# EAGLE schematic FJ60BLE (EAGLE 9.6.2)
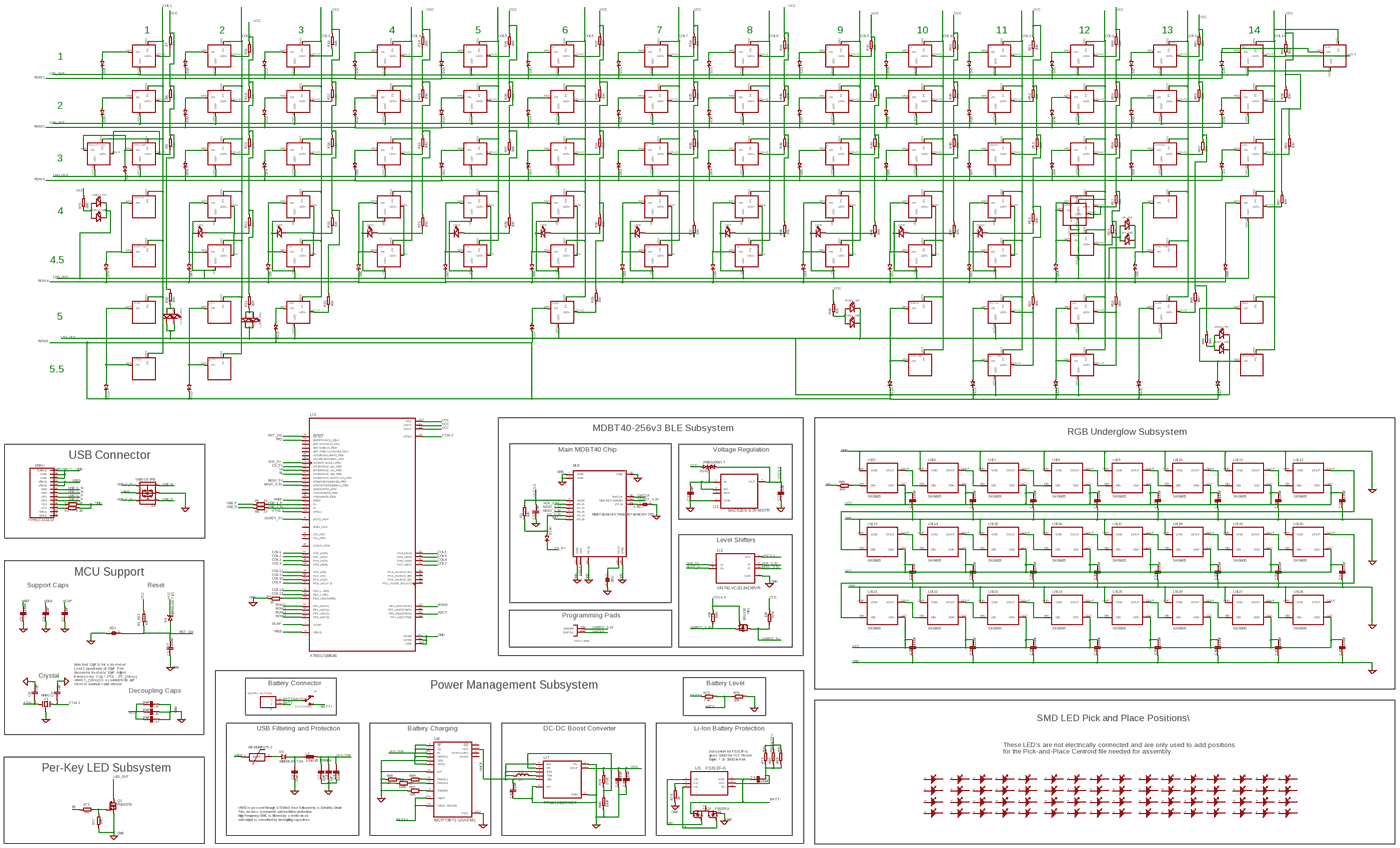
[diagram p0: schematic, sheet 1, overview]
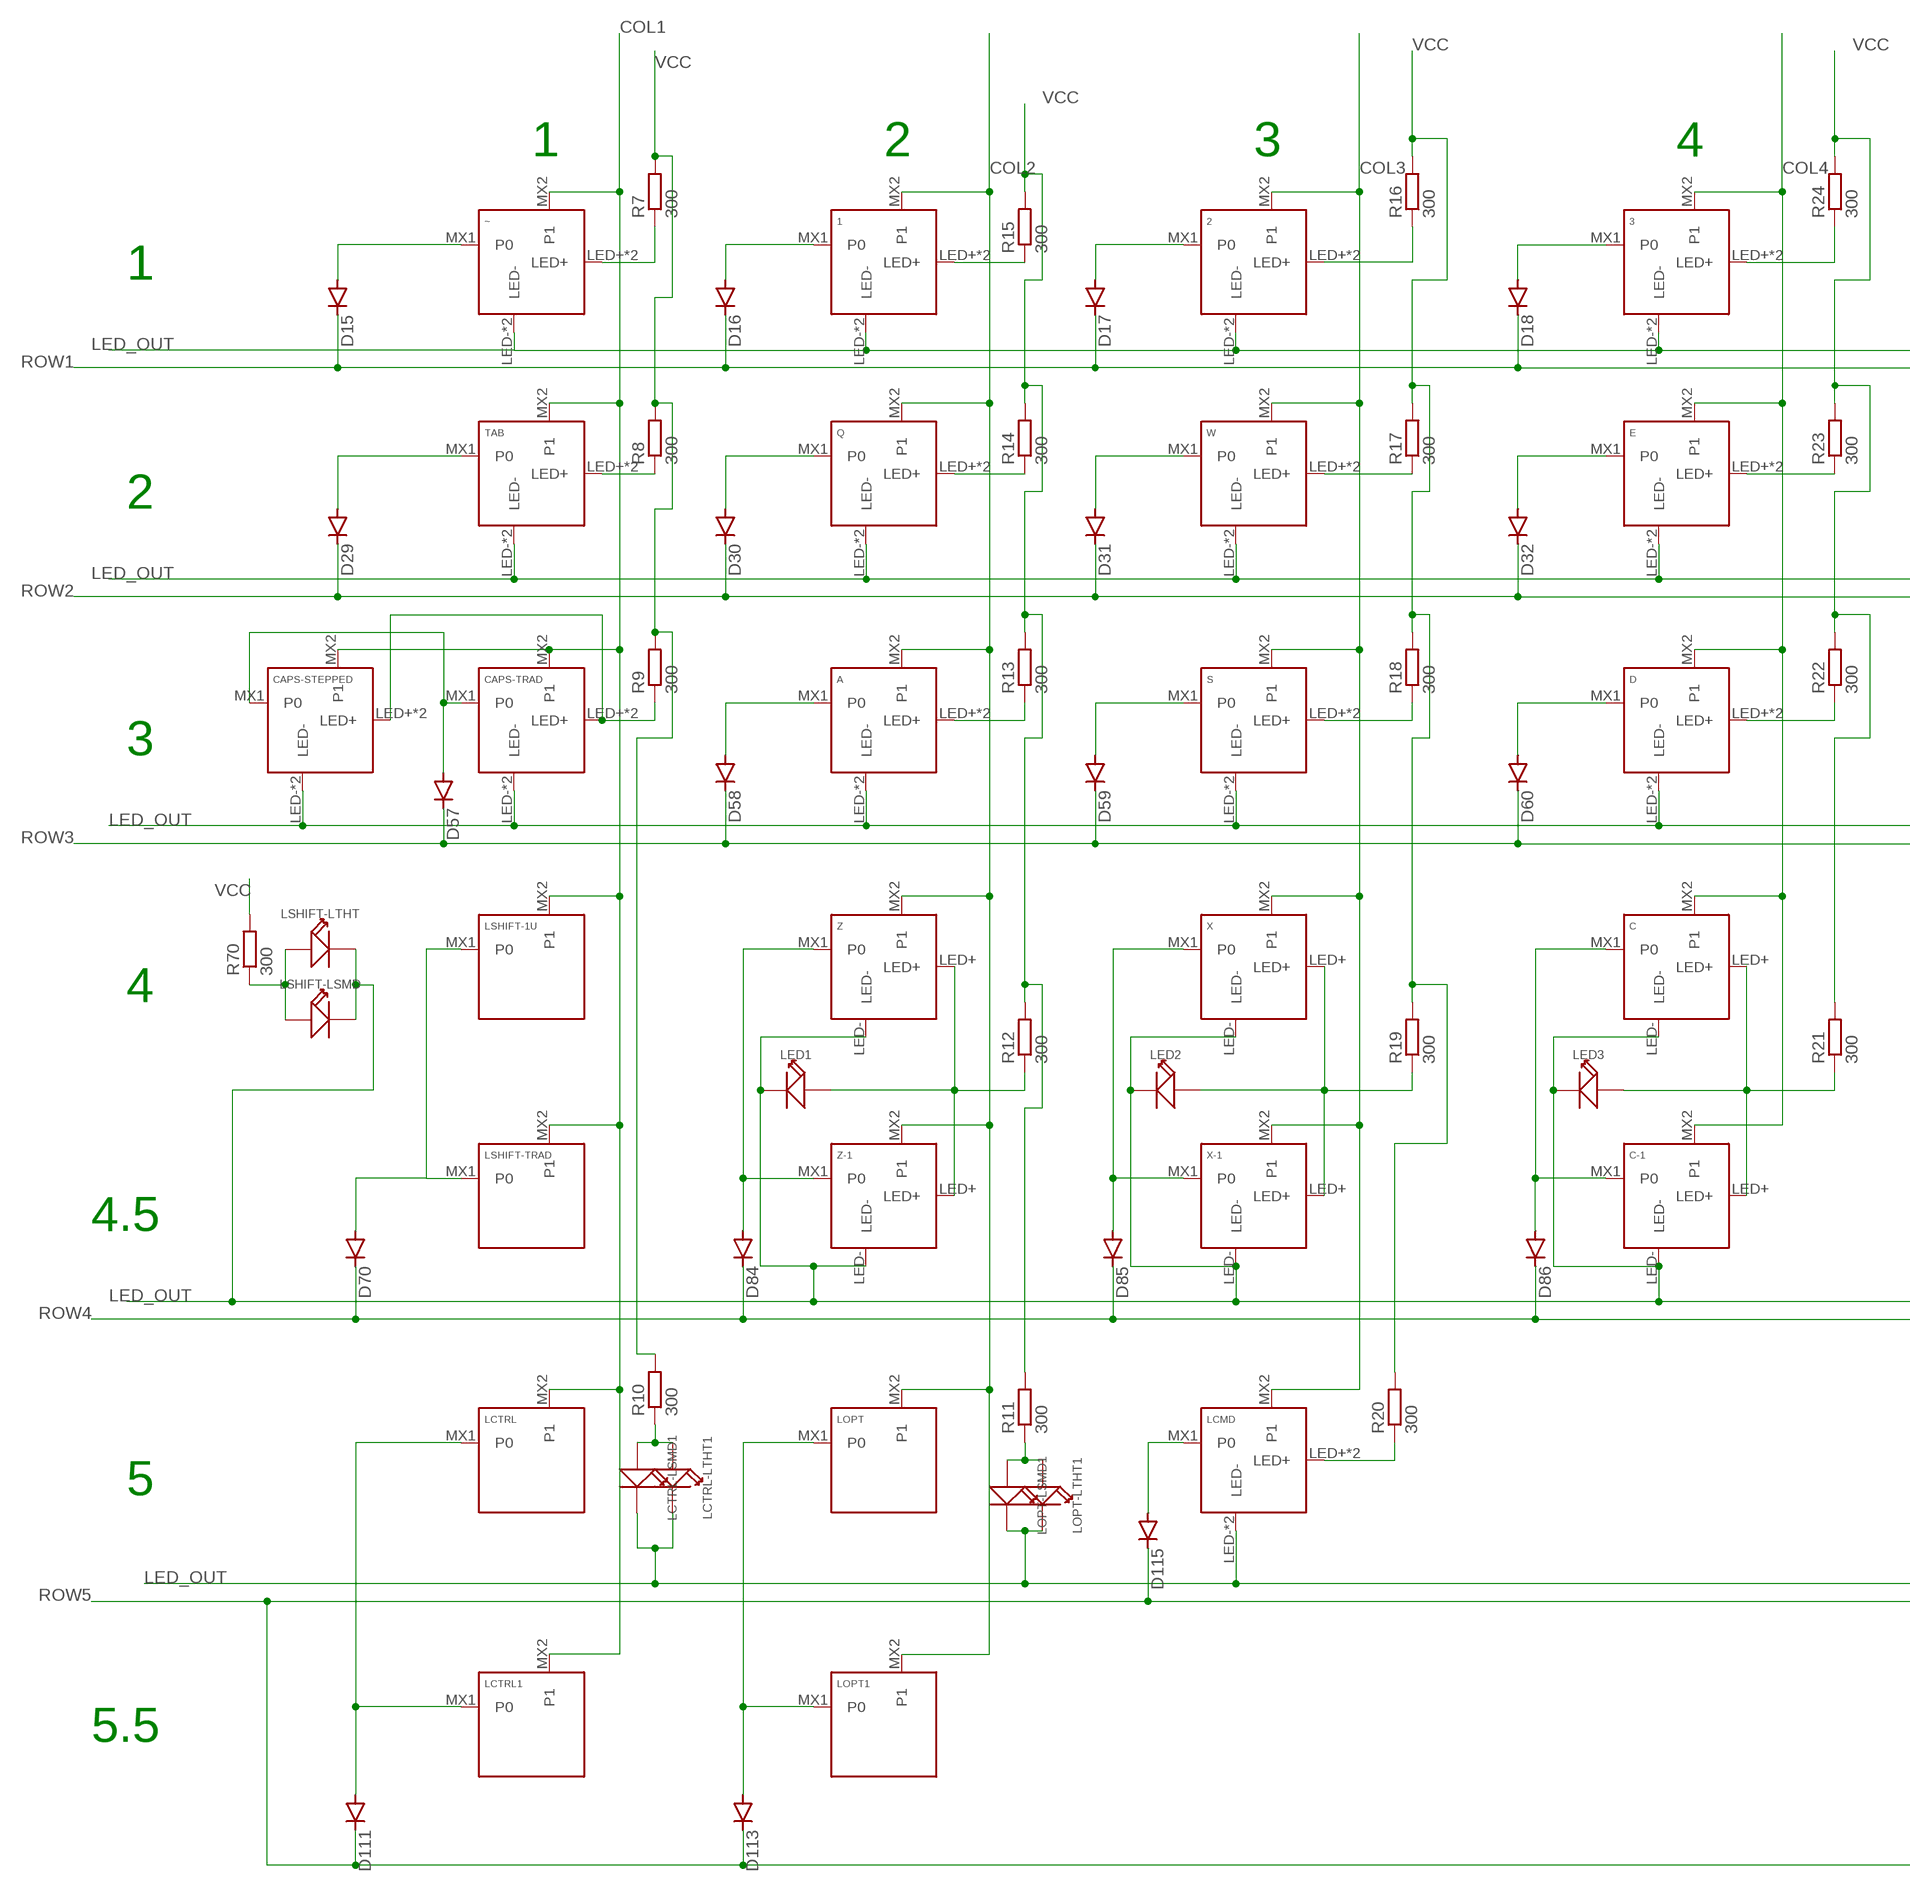
[diagram p1: schematic, sheet 1, part 1 of 6]
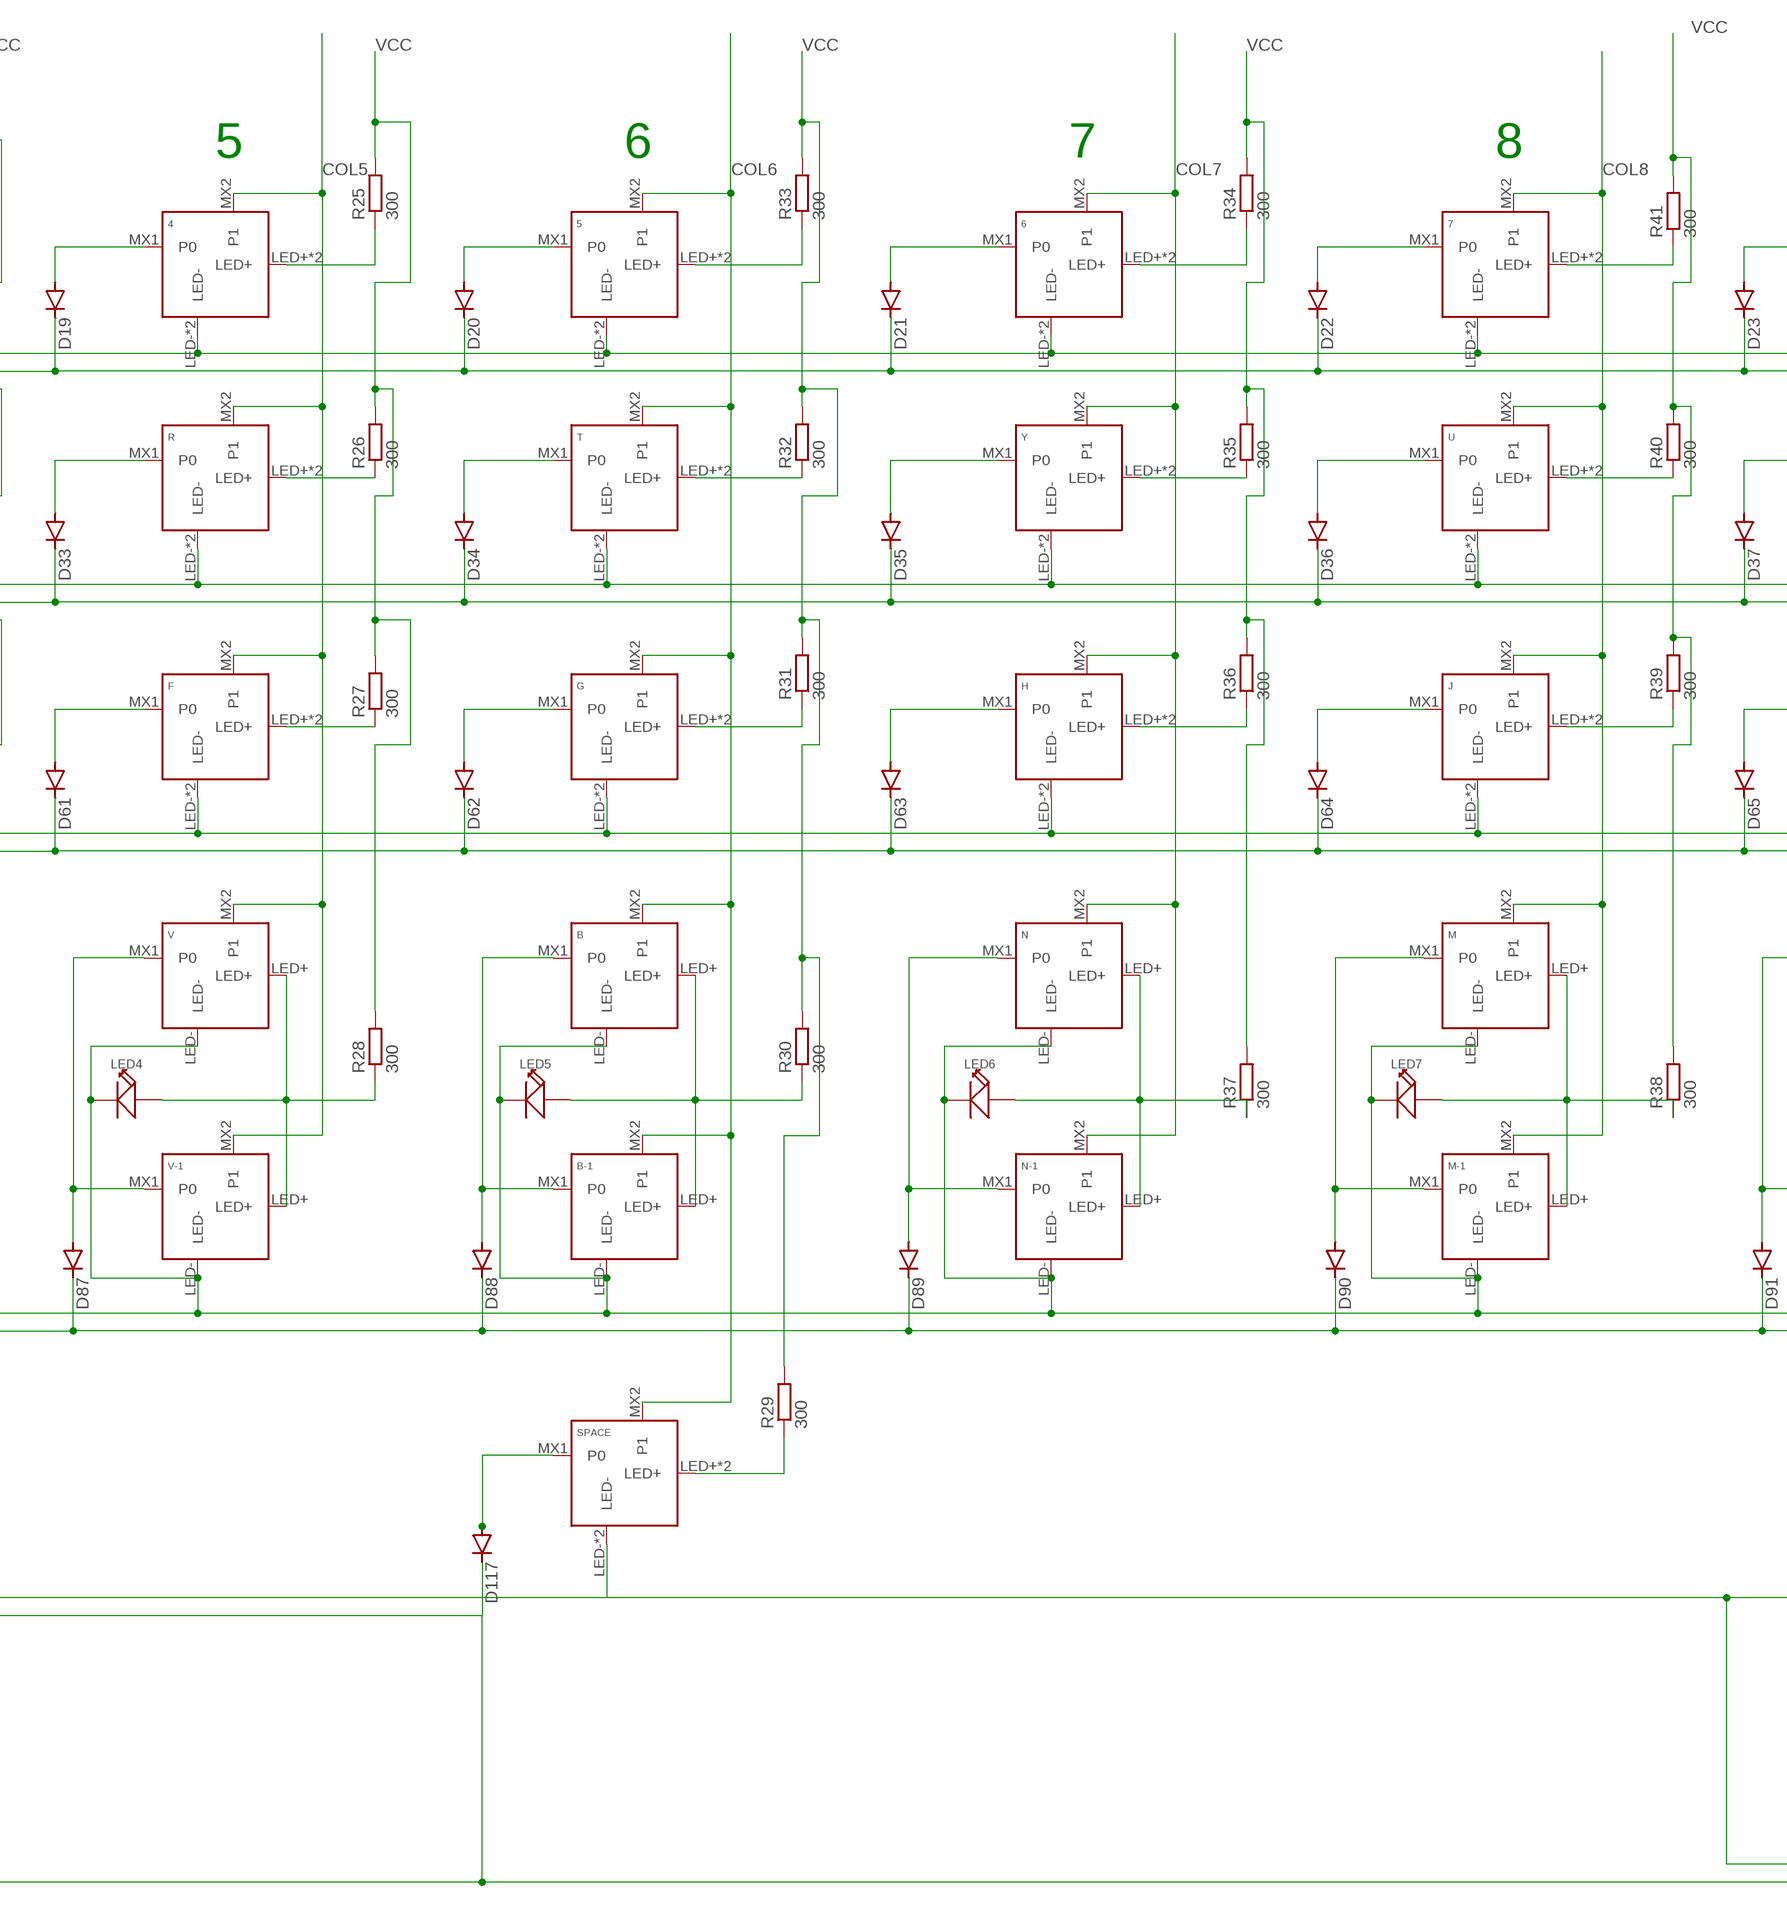
[diagram p2: schematic, sheet 1, part 2 of 6]
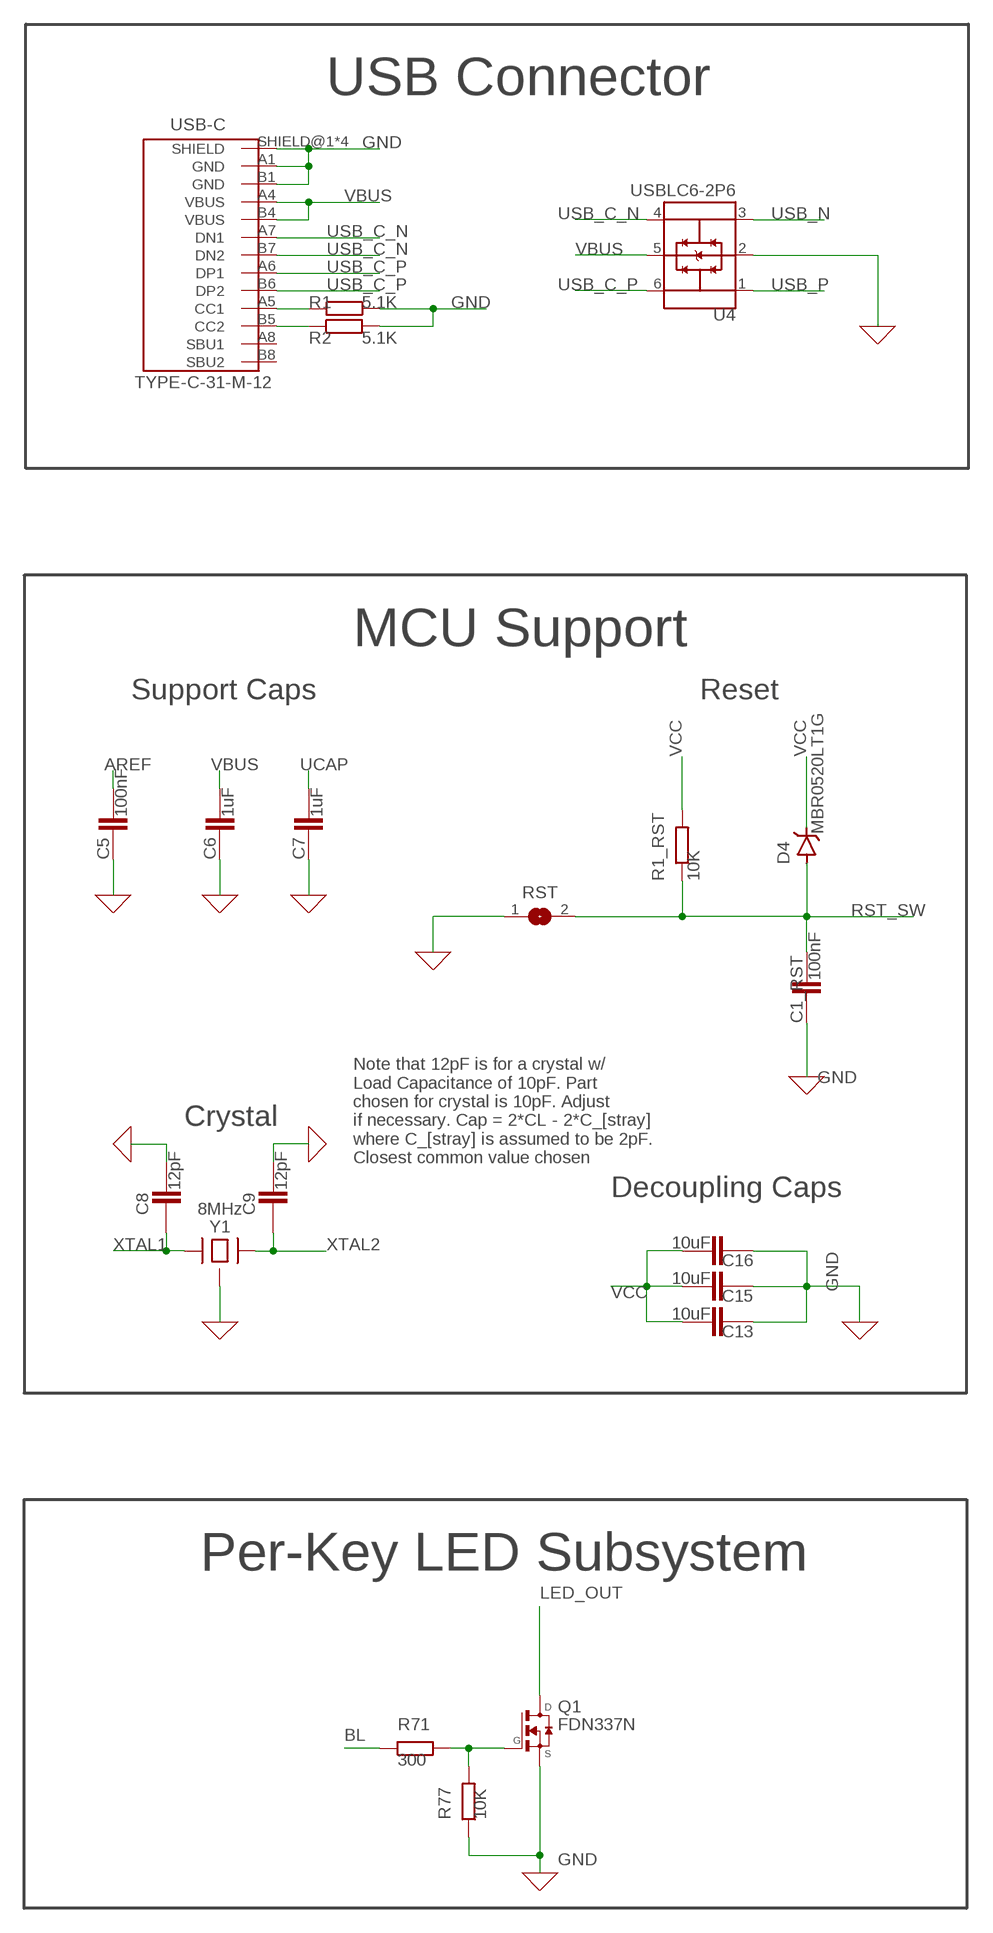
[diagram p3: schematic, sheet 1, part 3 of 6]
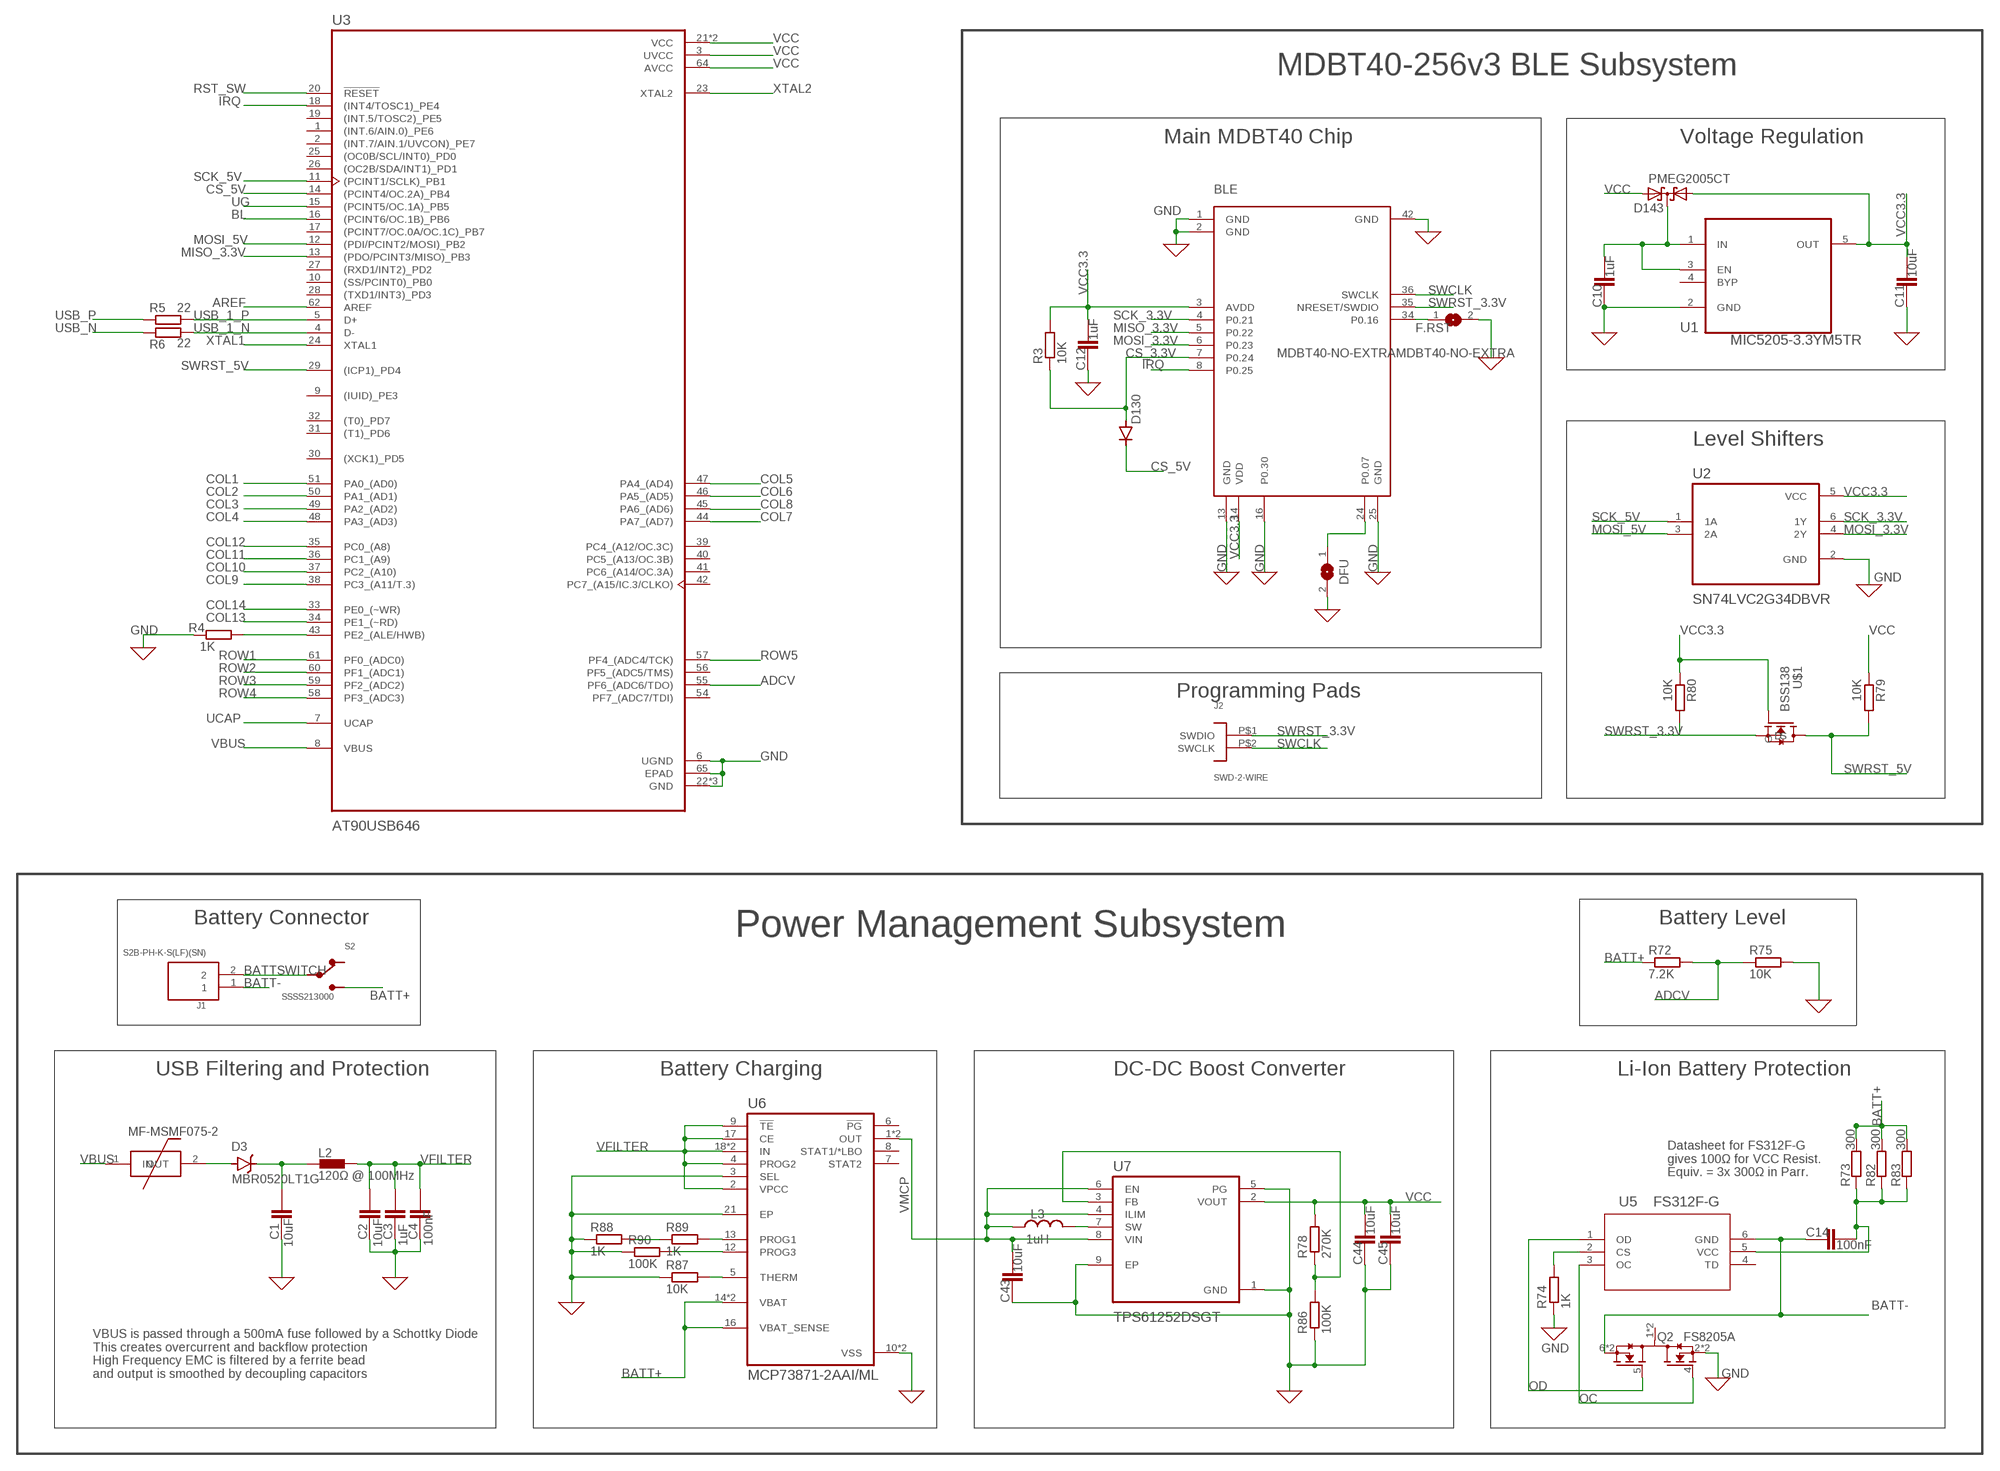
[diagram p4: schematic, sheet 1, part 4 of 6]
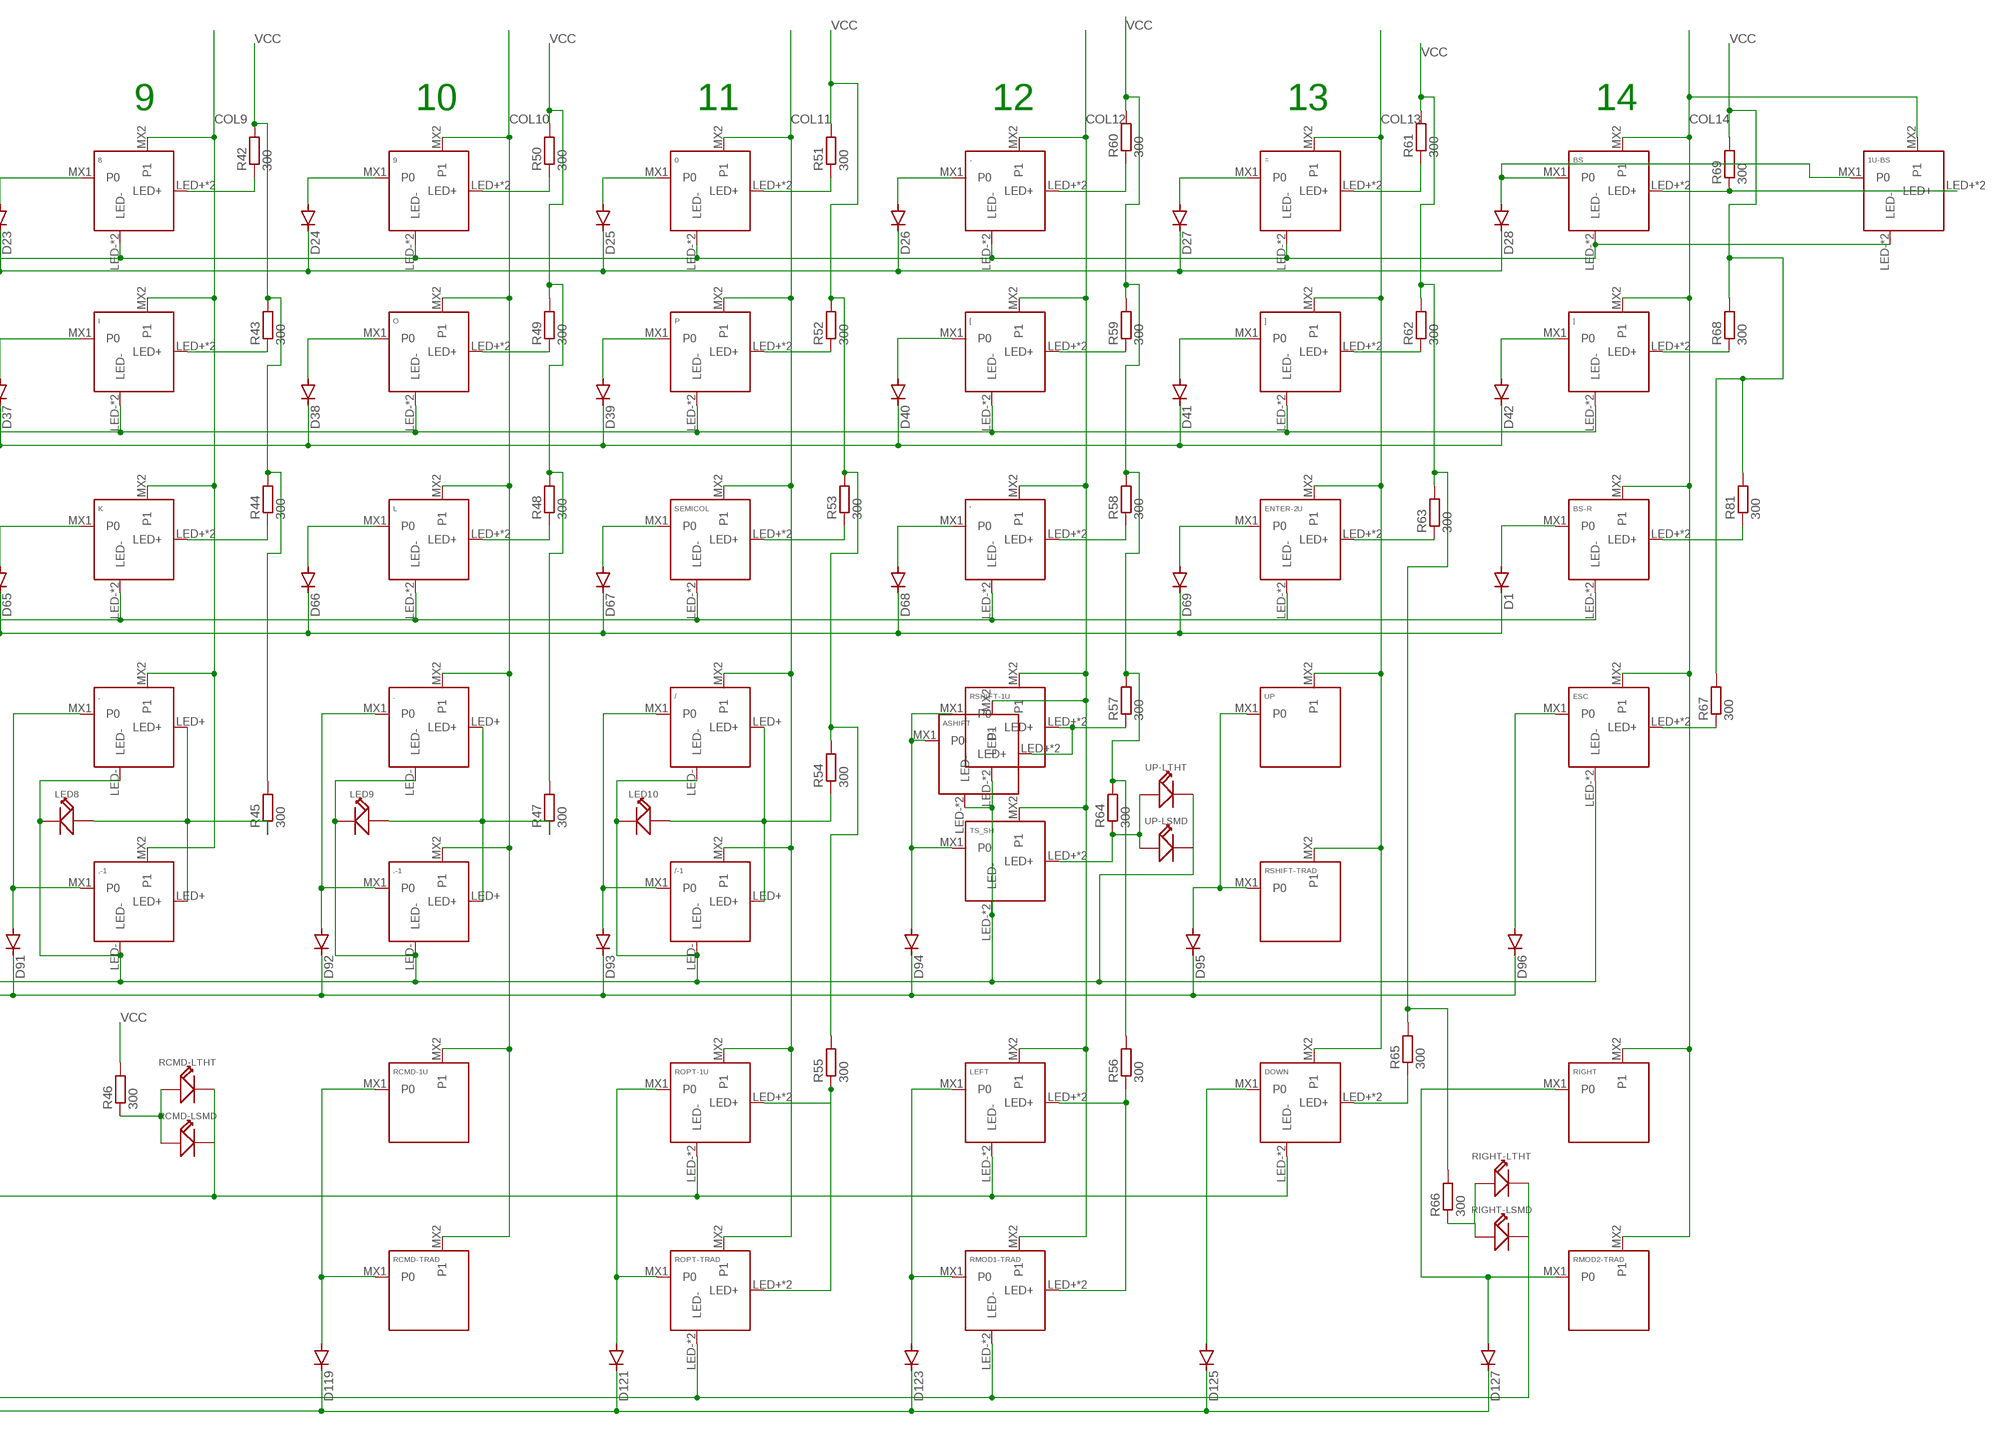
[diagram p5: schematic, sheet 1, part 5 of 6]
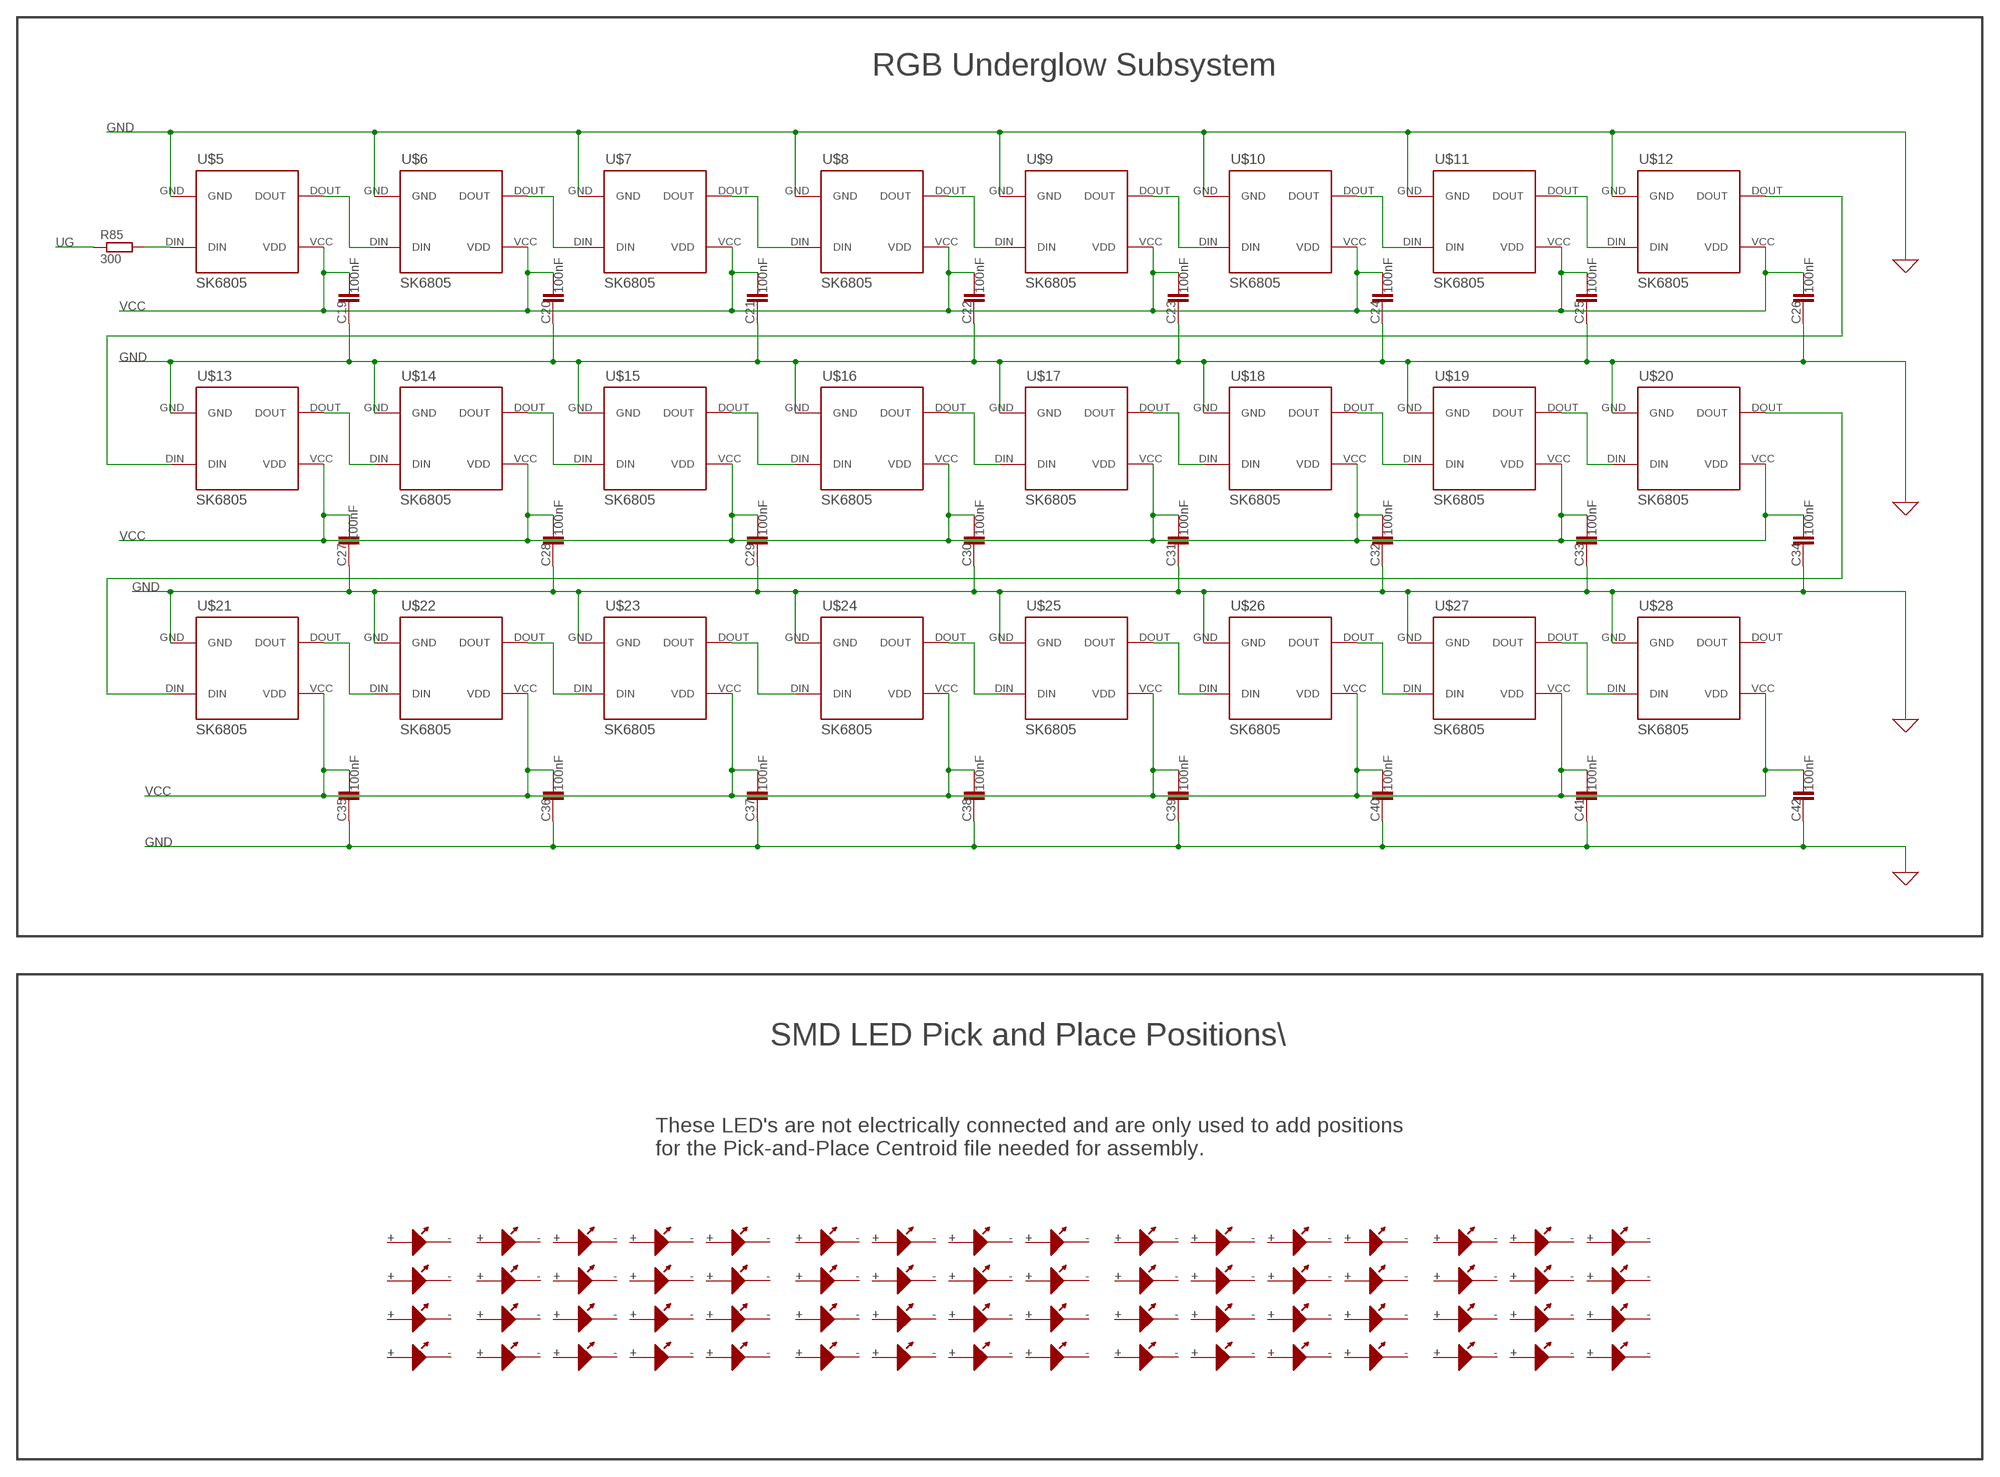
[diagram p6: schematic, sheet 1, part 6 of 6]

## Parts
0  KEYSWITCH-THTSMDLED-MX-1U-THTSMDLED  [MX-1U-THTSMDLED]
1  KEYSWITCH-THTSMDLED-MX-1U-THTSMDLED  [MX-1U-THTSMDLED]
1U-BS  KEYSWITCH-THTSMDLED-MX-1U-THTSMDLED  [MX-1U-THTSMDLED]
2  KEYSWITCH-THTSMDLED-MX-1U-THTSMDLED  [MX-1U-THTSMDLED]
3  KEYSWITCH-THTSMDLED-MX-1U-THTSMDLED  [MX-1U-THTSMDLED]
4  KEYSWITCH-THTSMDLED-MX-1U-THTSMDLED  [MX-1U-THTSMDLED]
5  KEYSWITCH-THTSMDLED-MX-1U-THTSMDLED  [MX-1U-THTSMDLED]
6  KEYSWITCH-THTSMDLED-MX-1U-THTSMDLED  [MX-1U-THTSMDLED]
7  KEYSWITCH-THTSMDLED-MX-1U-THTSMDLED  [MX-1U-THTSMDLED]
8  KEYSWITCH-THTSMDLED-MX-1U-THTSMDLED  [MX-1U-THTSMDLED]
9  KEYSWITCH-THTSMDLED-MX-1U-THTSMDLED  [MX-1U-THTSMDLED]
'  KEYSWITCH-THTSMDLED-MX-1U-THTSMDLED  [MX-1U-THTSMDLED]
,  KEYSWITCH-LED-MX-1U-LED  [MX-1U-LED]
,-1  KEYSWITCH-LED-MX-1U-LED  [MX-1U-LED]
-  KEYSWITCH-THTSMDLED-MX-1U-THTSMDLED  [MX-1U-THTSMDLED]
.  KEYSWITCH-LED-MX-1U-LED  [MX-1U-LED]
.-1  KEYSWITCH-LED-MX-1U-LED  [MX-1U-LED]
/  KEYSWITCH-LED-MX-1U-LED  [MX-1U-LED]
/-1  KEYSWITCH-LED-MX-1U-LED  [MX-1U-LED]
=  KEYSWITCH-THTSMDLED-MX-1U-THTSMDLED  [MX-1U-THTSMDLED]
[  KEYSWITCH-THTSMDLED-MX-1U-THTSMDLED  [MX-1U-THTSMDLED]
]  KEYSWITCH-THTSMDLED-MX-1U-THTSMDLED  [MX-1U-THTSMDLED]
A  KEYSWITCH-THTSMDLED-MX-1U-THTSMDLED  [MX-1U-THTSMDLED]
ASHIFT  KEYSWITCH-THTSMDLED-MX-1U-THTSMDLED  [MX-1U-THTSMDLED]
B  KEYSWITCH-LED-MX-1U-LED  [MX-1U-LED]
B-1  KEYSWITCH-LED-MX-1U-LED  [MX-1U-LED]
BLE  MDBT40-NO-EXTRAMDBT40-NO-EXTRA  [MDBT40-NO-EXTRA]
BS  KEYSWITCH-THTSMDLED-MX-2U-THTSMDLED-FLIPPED  [MX-2U-THTSMDLED-FLIPPED]
BS-R  KEYSWITCH-THTSMDLED-MX-1U-THTSMDLED  [MX-1U-THTSMDLED]
C  KEYSWITCH-LED-MX-1U-LED  [MX-1U-LED]
C1  10uF  CAPACITOR-0603  [C0603]
C1_RST  100nF  CAPACITOR-0603  [C0603]
C2  10uF  CAPACITOR-0603  [C0603]
C3  1uF  CAPACITOR-0603  [C0603]
C4  100nF  CAPACITOR-0603  [C0603]
C5  100nF  CAPACITOR-0603  [C0603]
C6  1uF  CAPACITOR-0603  [C0603]
C7  1uF  CAPACITOR-0603  [C0603]
C8  12pF  CAPACITOR-0603  [C0603]
C9  12pF  CAPACITOR-0603  [C0603]
C10  1uF  CAPACITOR-0603  [C0603]
C11  10uF  CAPACITOR-0603  [C0603]
C12  1uF  CAPACITOR-0603  [C0603]
C13  10uF  CAPACITOR-0603  [C0603]
C14  100nF  CAPACITOR-0603  [C0603]
C15  10uF  CAPACITOR-0603  [C0603]
C16  10uF  CAPACITOR-0603  [C0603]
C19  100nF  CAPACITOR-0603  [C0603]
C20  100nF  CAPACITOR-0603  [C0603]
C21  100nF  CAPACITOR-0603  [C0603]
C22  100nF  CAPACITOR-0603  [C0603]
C23  100nF  CAPACITOR-0603  [C0603]
C24  100nF  CAPACITOR-0603  [C0603]
C25  100nF  CAPACITOR-0603  [C0603]
C26  100nF  CAPACITOR-0603  [C0603]
C27  100nF  CAPACITOR-0603  [C0603]
C28  100nF  CAPACITOR-0603  [C0603]
C29  100nF  CAPACITOR-0603  [C0603]
C30  100nF  CAPACITOR-0603  [C0603]
C31  100nF  CAPACITOR-0603  [C0603]
C32  100nF  CAPACITOR-0603  [C0603]
C33  100nF  CAPACITOR-0603  [C0603]
C34  100nF  CAPACITOR-0603  [C0603]
C35  100nF  CAPACITOR-0603  [C0603]
C36  100nF  CAPACITOR-0603  [C0603]
C37  100nF  CAPACITOR-0603  [C0603]
C38  100nF  CAPACITOR-0603  [C0603]
C39  100nF  CAPACITOR-0603  [C0603]
C40  100nF  CAPACITOR-0603  [C0603]
C41  100nF  CAPACITOR-0603  [C0603]
C42  100nF  CAPACITOR-0603  [C0603]
C43  10uF  CAPACITOR-0603  [C0603]
C44  10uF  CAPACITOR-0603  [C0603]
C45  10uF  CAPACITOR-0603  [C0603]
C-1  KEYSWITCH-LED-MX-1U-LED  [MX-1U-LED]
CAPS-STEPPED  KEYSWITCH-THTSMDLED-MX-1U-THTSMDLED  [MX-1U-THTSMDLED]
CAPS-TRAD  KEYSWITCH-THTSMDLED-MX-1U-THTSMDLED  [MX-1U-THTSMDLED]
D  KEYSWITCH-THTSMDLED-MX-1U-THTSMDLED  [MX-1U-THTSMDLED]
D1  DIODE-SOD323-R  [SOD323-R]
D3  MBR0520LT1G  CESD5V0D1  [SOD-123]
D4  MBR0520LT1G  CESD5V0D1  [SOD-123]
D15  DIODE-SOD323-R  [SOD323-R]
D16  DIODE-SOD323-R  [SOD323-R]
D17  DIODE-SOD323-R  [SOD323-R]
D18  DIODE-SOD323-R  [SOD323-R]
D19  DIODE-SOD323-R  [SOD323-R]
D20  DIODE-SOD323-R  [SOD323-R]
D21  DIODE-SOD323-R  [SOD323-R]
D22  DIODE-SOD323-R  [SOD323-R]
D23  DIODE-SOD323-R  [SOD323-R]
D24  DIODE-SOD323-R  [SOD323-R]
D25  DIODE-SOD323-R  [SOD323-R]
D26  DIODE-SOD323-R  [SOD323-R]
D27  DIODE-SOD323-R  [SOD323-R]
D28  DIODE-SOD323-R  [SOD323-R]
D29  DIODE-SOD323-R  [SOD323-R]
D30  DIODE-SOD323-R  [SOD323-R]
D31  DIODE-SOD323-R  [SOD323-R]
D32  DIODE-SOD323-R  [SOD323-R]
D33  DIODE-SOD323-R  [SOD323-R]
D34  DIODE-SOD323-R  [SOD323-R]
D35  DIODE-SOD323-R  [SOD323-R]
D36  DIODE-SOD323-R  [SOD323-R]
D37  DIODE-SOD323-R  [SOD323-R]
D38  DIODE-SOD323-R  [SOD323-R]
D39  DIODE-SOD323-R  [SOD323-R]
D40  DIODE-SOD323-R  [SOD323-R]
D41  DIODE-SOD323-R  [SOD323-R]
D42  DIODE-SOD323-R  [SOD323-R]
D57  DIODE-SOD323-R  [SOD323-R]
D58  DIODE-SOD323-R  [SOD323-R]
D59  DIODE-SOD323-R  [SOD323-R]
D60  DIODE-SOD323-R  [SOD323-R]
D61  DIODE-SOD323-R  [SOD323-R]
D62  DIODE-SOD323-R  [SOD323-R]
D63  DIODE-SOD323-R  [SOD323-R]
D64  DIODE-SOD323-R  [SOD323-R]
D65  DIODE-SOD323-R  [SOD323-R]
D66  DIODE-SOD323-R  [SOD323-R]
D67  DIODE-SOD323-R  [SOD323-R]
D68  DIODE-SOD323-R  [SOD323-R]
D69  DIODE-SOD323-R  [SOD323-R]
D70  DIODE-SOD323-R  [SOD323-R]
D84  DIODE-SOD323-R  [SOD323-R]
D85  DIODE-SOD323-R  [SOD323-R]
D86  DIODE-SOD323-R  [SOD323-R]
D87  DIODE-SOD323-R  [SOD323-R]
D88  DIODE-SOD323-R  [SOD323-R]
D89  DIODE-SOD323-R  [SOD323-R]
D90  DIODE-SOD323-R  [SOD323-R]
D91  DIODE-SOD323-R  [SOD323-R]
D92  DIODE-SOD323-R  [SOD323-R]
D93  DIODE-SOD323-R  [SOD323-R]
D94  DIODE-SOD323-R  [SOD323-R]
D95  DIODE-SOD323-R  [SOD323-R]
D96  DIODE-SOD323-R  [SOD323-R]
D111  DIODE-SOD323-R  [SOD323-R]
D113  DIODE-SOD323-R  [SOD323-R]
D115  DIODE-SOD323-R  [SOD323-R]
D117  DIODE-SOD323-R  [SOD323-R]
D119  DIODE-SOD323-R  [SOD323-R]
D121  DIODE-SOD323-R  [SOD323-R]
D123  DIODE-SOD323-R  [SOD323-R]
D125  DIODE-SOD323-R  [SOD323-R]
D127  DIODE-SOD323-R  [SOD323-R]
D130  DIODE-SOD323-R  [SOD323-R]
D143  PMEG2005CT  [SOT23]
DFU  SJ  [SJ]
DOWN  KEYSWITCH-THTSMDLED-MX-1U-THTSMDLED  [MX-1U-THTSMDLED]
E  KEYSWITCH-THTSMDLED-MX-1U-THTSMDLED  [MX-1U-THTSMDLED]
ENTER-2U  KEYSWITCH-THTSMDLED-MX-2U-THTSMDLED-FLIPPED  [MX-2U-THTSMDLED-FLIPPED]
ESC  KEYSWITCH-THTSMDLED-MX-1U-THTSMDLED  [MX-1U-THTSMDLED]
F  KEYSWITCH-THTSMDLED-MX-1U-THTSMDLED  [MX-1U-THTSMDLED]
F1  MF-MSMF075-2  CAPC1210X112N1210  [CAPC1210X112N]
F.RST  SJ  [SJ]
G  KEYSWITCH-THTSMDLED-MX-1U-THTSMDLED  [MX-1U-THTSMDLED]
H  KEYSWITCH-THTSMDLED-MX-1U-THTSMDLED  [MX-1U-THTSMDLED]
I  KEYSWITCH-THTSMDLED-MX-1U-THTSMDLED  [MX-1U-THTSMDLED]
J  KEYSWITCH-THTSMDLED-MX-1U-THTSMDLED  [MX-1U-THTSMDLED]
J1  S2B-PH-K-S(LF)(SN)  [JST_S2B-PH-K-S(LF)(SN)]
J2  SWD-2-WIRE  [HEADER-2X1-2.54]
K  KEYSWITCH-THTSMDLED-MX-1U-THTSMDLED  [MX-1U-THTSMDLED]
L  KEYSWITCH-THTSMDLED-MX-1U-THTSMDLED  [MX-1U-THTSMDLED]
L2  120Ω @ 100MHz  BLM15HB221SN1  [0402]
L3  1uH  L_CHIP-0805(2012-METRIC)  [INDC2009X120]
LCMD  KEYSWITCH-THTSMDLED-MX-1U-THTSMDLED  [MX-1U-THTSMDLED]
LCTRL  KEYSWITCH-PLAIN-MX-1U  [MX-1U]
LCTRL1  KEYSWITCH-PLAIN-MX-1U  [MX-1U]
LCTRL-LSMD1  LED-2-PLACEMENT-SMD  [SMD-LED-UNIVERSAL-2-PLACEMENTS]
LCTRL-LTHT1  LED-2-PLACEMENT-THT  [LED-THT-2PLACEMENT]
LED1  LED-4-PLACEMENT-SMD  [SMD-LED-UNIVERSAL-DUAL]
LED2  LED-4-PLACEMENT-SMD  [SMD-LED-UNIVERSAL-DUAL]
LED3  LED-4-PLACEMENT-SMD  [SMD-LED-UNIVERSAL-DUAL]
LED4  LED-4-PLACEMENT-SMD  [SMD-LED-UNIVERSAL-DUAL]
LED5  LED-4-PLACEMENT-SMD  [SMD-LED-UNIVERSAL-DUAL]
LED6  LED-4-PLACEMENT-SMD  [SMD-LED-UNIVERSAL-DUAL]
LED7  LED-4-PLACEMENT-SMD  [SMD-LED-UNIVERSAL-DUAL]
LED8  LED-4-PLACEMENT-SMD  [SMD-LED-UNIVERSAL-DUAL]
LED9  LED-4-PLACEMENT-SMD  [SMD-LED-UNIVERSAL-DUAL]
LED10  LED-4-PLACEMENT-SMD  [SMD-LED-UNIVERSAL-DUAL]
LEFT  KEYSWITCH-THTSMDLED-MX-1U-THTSMDLED  [MX-1U-THTSMDLED]
LOPT  KEYSWITCH-PLAIN-MX-1U  [MX-1U]
LOPT1  KEYSWITCH-PLAIN-MX-1U  [MX-1U]
LOPT-LSMD1  LED-2-PLACEMENT-SMD  [SMD-LED-UNIVERSAL-2-PLACEMENTS]
LOPT-LTHT1  LED-2-PLACEMENT-THT  [LED-THT-2PLACEMENT]
LSHIFT-1U  KEYSWITCH-PLAIN-MX-2U-FLIPPED  [MX-2U-FLIPPED]
LSHIFT-LSMD  LED-2-PLACEMENT-SMD  [SMD-LED-UNIVERSAL-2-PLACEMENTS]
LSHIFT-LTHT  LED-2-PLACEMENT-THT  [LED-THT-2PLACEMENT]
LSHIFT-TRAD  KEYSWITCH-PLAIN-MX-2U-FLIPPED  [MX-2U-FLIPPED]
M  KEYSWITCH-LED-MX-1U-LED  [MX-1U-LED]
M-1  KEYSWITCH-LED-MX-1U-LED  [MX-1U-LED]
N  KEYSWITCH-LED-MX-1U-LED  [MX-1U-LED]
N-1  KEYSWITCH-LED-MX-1U-LED  [MX-1U-LED]
O  KEYSWITCH-THTSMDLED-MX-1U-THTSMDLED  [MX-1U-THTSMDLED]
P  KEYSWITCH-THTSMDLED-MX-1U-THTSMDLED  [MX-1U-THTSMDLED]
Q  KEYSWITCH-THTSMDLED-MX-1U-THTSMDLED  [MX-1U-THTSMDLED]
Q1  FDN337N  [SSOT-3]
Q2  FS8205A  [SOP65P640X120-8N]
R  KEYSWITCH-THTSMDLED-MX-1U-THTSMDLED  [MX-1U-THTSMDLED]
R1  5.1K  RESISTOR-0405  [R0402]
R1_RST  10K  RESISTOR-0405  [R0402]
R2  5.1K  RESISTOR-0405  [R0402]
R3  10K  RESISTOR-0405  [R0402]
R4  1K  RESISTOR-0405  [R0402]
R5  22  RESISTOR-0405  [R0402]
R6  22  RESISTOR-0405  [R0402]
R7  300  RESISTOR-0603  [R0603]
R8  300  RESISTOR-0603  [R0603]
R9  300  RESISTOR-0603  [R0603]
R10  300  RESISTOR-0603  [R0603]
R11  300  RESISTOR-0603  [R0603]
R12  300  RESISTOR-0603  [R0603]
R13  300  RESISTOR-0603  [R0603]
R14  300  RESISTOR-0603  [R0603]
R15  300  RESISTOR-0603  [R0603]
R16  300  RESISTOR-0603  [R0603]
R17  300  RESISTOR-0603  [R0603]
R18  300  RESISTOR-0603  [R0603]
R19  300  RESISTOR-0603  [R0603]
R20  300  RESISTOR-0603  [R0603]
R21  300  RESISTOR-0603  [R0603]
R22  300  RESISTOR-0603  [R0603]
R23  300  RESISTOR-0603  [R0603]
R24  300  RESISTOR-0603  [R0603]
R25  300  RESISTOR-0603  [R0603]
R26  300  RESISTOR-0603  [R0603]
R27  300  RESISTOR-0603  [R0603]
R28  300  RESISTOR-0603  [R0603]
R29  300  RESISTOR-0603  [R0603]
R30  300  RESISTOR-0603  [R0603]
R31  300  RESISTOR-0603  [R0603]
R32  300  RESISTOR-0603  [R0603]
R33  300  RESISTOR-0603  [R0603]
R34  300  RESISTOR-0603  [R0603]
R35  300  RESISTOR-0603  [R0603]
R36  300  RESISTOR-0603  [R0603]
R37  300  RESISTOR-0603  [R0603]
R38  300  RESISTOR-0603  [R0603]
R39  300  RESISTOR-0603  [R0603]
R40  300  RESISTOR-0603  [R0603]
R41  300  RESISTOR-0603  [R0603]
R42  300  RESISTOR-0603  [R0603]
R43  300  RESISTOR-0603  [R0603]
R44  300  RESISTOR-0603  [R0603]
R45  300  RESISTOR-0603  [R0603]
R46  300  RESISTOR-0603  [R0603]
R47  300  RESISTOR-0603  [R0603]
R48  300  RESISTOR-0603  [R0603]
R49  300  RESISTOR-0603  [R0603]
R50  300  RESISTOR-0603  [R0603]
R51  300  RESISTOR-0603  [R0603]
R52  300  RESISTOR-0603  [R0603]
R53  300  RESISTOR-0603  [R0603]
R54  300  RESISTOR-0603  [R0603]
R55  300  RESISTOR-0603  [R0603]
R56  300  RESISTOR-0603  [R0603]
R57  300  RESISTOR-0603  [R0603]
R58  300  RESISTOR-0603  [R0603]
R59  300  RESISTOR-0603  [R0603]
R60  300  RESISTOR-0603  [R0603]
R61  300  RESISTOR-0603  [R0603]
R62  300  RESISTOR-0603  [R0603]
R63  300  RESISTOR-0603  [R0603]
R64  300  RESISTOR-0603  [R0603]
R65  300  RESISTOR-0603  [R0603]
R66  300  RESISTOR-0603  [R0603]
R67  300  RESISTOR-0603  [R0603]
R68  300  RESISTOR-0603  [R0603]
R69  300  RESISTOR-0603  [R0603]
R70  300  RESISTOR-0603  [R0603]
R71  300  RESISTOR-0603  [R0603]
R72  7.2K  RESISTOR-0405  [R0402]
R73  300  RESISTOR-0603  [R0603]
R74  1K  RESISTOR-0405  [R0402]
R75  10K  RESISTOR-0405  [R0402]
R77  10K  RESISTOR-0405  [R0402]
R78  270K  RESISTOR-0405  [R0402]
R79  10K  RESISTOR-0405  [R0402]
R80  10K  RESISTOR-0405  [R0402]
R81  300  RESISTOR-0603  [R0603]
R82  300  RESISTOR-0603  [R0603]
R83  300  RESISTOR-0603  [R0603]
R85  300  RESISTOR-0603  [R0603]
R86  100K  RESISTOR-0405  [R0402]
R87  10K  RESISTOR-0405  [R0402]
R88  1K  RESISTOR-0405  [R0402]
R89  1K  RESISTOR-0405  [R0402]
R90  100K  RESISTOR-0405  [R0402]
RCMD-1U  KEYSWITCH-PLAIN-MX-1U  [MX-1U]
RCMD-LSMD  LED-2-PLACEMENT-SMD  [SMD-LED-UNIVERSAL-2-PLACEMENTS]
RCMD-LTHT  LED-2-PLACEMENT-THT  [LED-THT-2PLACEMENT]
RCMD-TRAD  KEYSWITCH-PLAIN-MX-1U  [MX-1U]
RIGHT  KEYSWITCH-PLAIN-MX-1U  [MX-1U]
RIGHT-LSMD  LED-2-PLACEMENT-SMD  [SMD-LED-UNIVERSAL-2-PLACEMENTS]
RIGHT-LTHT  LED-2-PLACEMENT-THT  [LED-THT-2PLACEMENT]
RMOD1-TRAD  KEYSWITCH-THTSMDLED-MX-1U-THTSMDLED  [MX-1U-THTSMDLED]
RMOD2-TRAD  KEYSWITCH-PLAIN-MX-1U  [MX-1U]
ROPT-1U  KEYSWITCH-THTSMDLED-MX-1U-THTSMDLED  [MX-1U-THTSMDLED]
ROPT-TRAD  KEYSWITCH-THTSMDLED-MX-1U-THTSMDLED  [MX-1U-THTSMDLED]
RSHIFT-1U  KEYSWITCH-THTSMDLED-MX-1U-THTSMDLED  [MX-1U-THTSMDLED]
RSHIFT-TRAD  KEYSWITCH-PLAIN-MX-1U  [MX-1U]
RST  SJ  [SJ]
S  KEYSWITCH-THTSMDLED-MX-1U-THTSMDLED  [MX-1U-THTSMDLED]
S2  SSSS213000  [SSSS213000]
SEMICOL  KEYSWITCH-THTSMDLED-MX-1U-THTSMDLED  [MX-1U-THTSMDLED]
SPACE  KEYSWITCH-THTSMDLED-MX-6.25U-THTSMDLED  [MX-6.25U-THTSMDLED]
T  KEYSWITCH-THTSMDLED-MX-1U-THTSMDLED  [MX-1U-THTSMDLED]
TAB  KEYSWITCH-THTSMDLED-MX-1U-THTSMDLED  [MX-1U-THTSMDLED]
TS_SH  KEYSWITCH-THTSMDLED-MX-1U-THTSMDLED  [MX-1U-THTSMDLED]
U  KEYSWITCH-THTSMDLED-MX-1U-THTSMDLED  [MX-1U-THTSMDLED]
U1  MIC5205-3.3YM5TR  [SOT95P280X130-5N]
U2  SN74LVC2G34DBVR  [SOT95P280X145-6N]
U3  AT90USB646  AT90USB1286-MU  [QFN50P900X900X100-65N]
U4  USBLC6-2P6  [SOT50P160X60-6N]
U5  FS312F-G  [FS312F-G]
U6  MCP73871-2AAI/ML  [QFN50P400X400X100-21N]
U7  TPS61252DSGT  [SON50P200X200X80-9N]
U$1  BSS138  [SOT-23]
U$5  SK6805  [SK6805]
U$6  SK6805  [SK6805]
U$7  SK6805  [SK6805]
U$8  SK6805  [SK6805]
U$9  SK6805  [SK6805]
U$10  SK6805  [SK6805]
U$11  SK6805  [SK6805]
U$12  SK6805  [SK6805]
U$13  SK6805  [SK6805]
U$14  SK6805  [SK6805]
U$15  SK6805  [SK6805]
U$16  SK6805  [SK6805]
U$17  SK6805  [SK6805]
U$18  SK6805  [SK6805]
U$19  SK6805  [SK6805]
U$20  SK6805  [SK6805]
U$21  SK6805  [SK6805]
U$22  SK6805  [SK6805]
U$23  SK6805  [SK6805]
U$24  SK6805  [SK6805]
U$25  SK6805  [SK6805]
U$26  SK6805  [SK6805]
U$27  SK6805  [SK6805]
U$28  SK6805  [SK6805]
U$29  LED-0805  [LED0805]
U$30  LED-0805  [LED0805]
U$31  LED-0805  [LED0805]
U$32  LED-0805  [LED0805]
U$33  LED-0805  [LED0805]
U$34  LED-0805  [LED0805]
U$35  LED-0805  [LED0805]
U$36  LED-0805  [LED0805]
U$37  LED-0805  [LED0805]
U$38  LED-0805  [LED0805]
U$39  LED-0805  [LED0805]
U$40  LED-0805  [LED0805]
U$41  LED-0805  [LED0805]
U$42  LED-0805  [LED0805]
U$43  LED-0805  [LED0805]
U$44  LED-0805  [LED0805]
U$45  LED-0805  [LED0805]
U$46  LED-0805  [LED0805]
U$47  LED-0805  [LED0805]
U$48  LED-0805  [LED0805]
U$49  LED-0805  [LED0805]
U$50  LED-0805  [LED0805]
U$51  LED-0805  [LED0805]
U$52  LED-0805  [LED0805]
U$53  LED-0805  [LED0805]
U$54  LED-0805  [LED0805]
U$55  LED-0805  [LED0805]
U$56  LED-0805  [LED0805]
U$57  LED-0805  [LED0805]
U$58  LED-0805  [LED0805]
U$59  LED-0805  [LED0805]
U$60  LED-0805  [LED0805]
U$61  LED-0805  [LED0805]
U$62  LED-0805  [LED0805]
U$63  LED-0805  [LED0805]
U$64  LED-0805  [LED0805]
U$65  LED-0805  [LED0805]
U$66  LED-0805  [LED0805]
U$67  LED-0805  [LED0805]
U$68  LED-0805  [LED0805]
U$69  LED-0805  [LED0805]
U$70  LED-0805  [LED0805]
U$71  LED-0805  [LED0805]
U$72  LED-0805  [LED0805]
U$73  LED-0805  [LED0805]
U$74  LED-0805  [LED0805]
U$75  LED-0805  [LED0805]
U$76  LED-0805  [LED0805]
U$77  LED-0805  [LED0805]
U$78  LED-0805  [LED0805]
U$79  LED-0805  [LED0805]
U$80  LED-0805  [LED0805]
U$81  LED-0805  [LED0805]
U$82  LED-0805  [LED0805]
U$83  LED-0805  [LED0805]
U$84  LED-0805  [LED0805]
U$85  LED-0805  [LED0805]
U$86  LED-0805  [LED0805]
U$87  LED-0805  [LED0805]
U$88  LED-0805  [LED0805]
U$89  LED-0805  [LED0805]
U$90  LED-0805  [LED0805]
U$91  LED-0805  [LED0805]
U$92  LED-0805  [LED0805]
UP  KEYSWITCH-PLAIN-MX-1U  [MX-1U]
UP-LSMD  LED-2-PLACEMENT-SMD  [SMD-LED-UNIVERSAL-2-PLACEMENTS]
UP-LTHT  LED-2-PLACEMENT-THT  [LED-THT-2PLACEMENT]
USB-C  USB-C  [TYPE-C-31-M-12]
V  KEYSWITCH-LED-MX-1U-LED  [MX-1U-LED]
V-1  KEYSWITCH-LED-MX-1U-LED  [MX-1U-LED]
W  KEYSWITCH-THTSMDLED-MX-1U-THTSMDLED  [MX-1U-THTSMDLED]
X  KEYSWITCH-LED-MX-1U-LED  [MX-1U-LED]
X-1  KEYSWITCH-LED-MX-1U-LED  [MX-1U-LED]
Y  KEYSWITCH-THTSMDLED-MX-1U-THTSMDLED  [MX-1U-THTSMDLED]
Y1  8MHz  CRYSTAL-4PIN-3.2X2.5  [CRYSTAL-3.2X2.5]
Z  KEYSWITCH-LED-MX-1U-LED  [MX-1U-LED]
Z-1  KEYSWITCH-LED-MX-1U-LED  [MX-1U-LED]
|  KEYSWITCH-THTSMDLED-MX-1U-THTSMDLED  [MX-1U-THTSMDLED]
~  KEYSWITCH-THTSMDLED-MX-1U-THTSMDLED  [MX-1U-THTSMDLED]

## Nets
ADCV: R72.2 R75.1 U3.55(PF6_(ADC6/TDO))
AREF: C5.2 U3.62(AREF)
BATT+: R72.1 R73.2 R82.2 R83.2 S2.P3 U6.14(VBAT) U6.15(VBAT) U6.16(VBAT_SENSE)
BATT-: C14.1 J1.1 Q2.6(S2) Q2.7(S2) U5.6(GND)
BATTSWITCH: J1.2 S2.P2
BL: R71.1 U3.16((PCINT6/OC.1B)_PB6)
COL1 [Matrix-Signals]: CAPS-STEPPED.MX2(P1) CAPS-TRAD.MX2(P1) LCTRL1.MX2(P1) LCTRL.MX2(P1) LSHIFT-1U.MX2(P1) LSHIFT-TRAD.MX2(P1) TAB.MX2(P1) U3.51(PA0_(AD0)) ~.MX2(P1)
COL2 [Matrix-Signals]: 1.MX2(P1) A.MX2(P1) LOPT1.MX2(P1) LOPT.MX2(P1) Q.MX2(P1) U3.50(PA1_(AD1)) Z-1.MX2(P1) Z.MX2(P1)
COL3 [Matrix-Signals]: 2.MX2(P1) LCMD.MX2(P1) S.MX2(P1) U3.49(PA2_(AD2)) W.MX2(P1) X-1.MX2(P1) X.MX2(P1)
COL4 [Matrix-Signals]: 3.MX2(P1) C-1.MX2(P1) C.MX2(P1) D.MX2(P1) E.MX2(P1) U3.48(PA3_(AD3))
COL5 [Matrix-Signals]: 4.MX2(P1) F.MX2(P1) R.MX2(P1) U3.47(PA4_(AD4)) V-1.MX2(P1) V.MX2(P1)
COL6 [Matrix-Signals]: 5.MX2(P1) B-1.MX2(P1) B.MX2(P1) G.MX2(P1) SPACE.MX2(P1) T.MX2(P1) U3.46(PA5_(AD5))
COL7 [Matrix-Signals]: 6.MX2(P1) H.MX2(P1) N-1.MX2(P1) N.MX2(P1) U3.44(PA7_(AD7)) Y.MX2(P1)
COL8 [Matrix-Signals]: 7.MX2(P1) J.MX2(P1) M-1.MX2(P1) M.MX2(P1) U3.45(PA6_(AD6)) U.MX2(P1)
COL9 [Matrix-Signals]: 8.MX2(P1) ,-1.MX2(P1) ,.MX2(P1) I.MX2(P1) K.MX2(P1) U3.38(PC3_(A11/T.3))
COL10 [Matrix-Signals]: 9.MX2(P1) .-1.MX2(P1) ..MX2(P1) L.MX2(P1) O.MX2(P1) RCMD-1U.MX2(P1) RCMD-TRAD.MX2(P1) U3.37(PC2_(A10))
COL11 [Matrix-Signals]: 0.MX2(P1) /-1.MX2(P1) /.MX2(P1) P.MX2(P1) ROPT-1U.MX2(P1) ROPT-TRAD.MX2(P1) SEMICOL.MX2(P1) U3.36(PC1_(A9))
COL12 [Matrix-Signals]: '.MX2(P1) -.MX2(P1) [.MX2(P1) ASHIFT.MX2(P1) LEFT.MX2(P1) RMOD1-TRAD.MX2(P1) RSHIFT-1U.MX2(P1) TS_SH.MX2(P1) U3.35(PC0_(A8))
COL13 [Matrix-Signals]: =.MX2(P1) ].MX2(P1) DOWN.MX2(P1) ENTER-2U.MX2(P1) RSHIFT-TRAD.MX2(P1) U3.34(PE1_(~RD)) UP.MX2(P1)
COL14 [Matrix-Signals]: 1U-BS.MX2(P1) BS-R.MX2(P1) BS.MX2(P1) ESC.MX2(P1) RIGHT.MX2(P1) RMOD2-TRAD.MX2(P1) U3.33(PE0_(~WR)) |.MX2(P1)
CS_3.3V: BLE.7(P0.24) D130.A R3.1
CS_5V: D130.C U3.14((PCINT4/OC.2A)_PB4)
GND [Power]: BLE.1(GND) BLE.2(GND) BLE.13(GND) BLE.16(P0.30) BLE.25(GND) BLE.42(GND) C1.1 C1_RST.1 C2.1 C3.1 C4.1 C5.1 C6.1 C7.1 C8.2 C9.2 C10.1 C11.1 C12.1 C13.1 C15.1 C16.1 C19.1 C20.1 C21.1 C22.1 C23.1 C24.1 C25.1 C26.1 C27.1 C28.1 C29.1 C30.1 C31.1 C32.1 C33.1 C34.1 C35.1 C36.1 C37.1 C38.1 C39.1 C40.1 C41.1 C42.1 C43.1 C44.1 C45.1 DFU.2 F.RST.2 Q1.2(S) Q2.2(S1) Q2.3(S1) R1.1 R2.2 R4.1 R74.1 R75.2 R77.1 R86.1 R87.1 R88.1 R90.1 RST.1 U1.2(GND) U2.2(GND) U3.6(UGND) U3.22(GND) U3.53(GND) U3.63(GND) U3.65(EPAD) U4.2(GND) U6.3(SEL) U6.10(VSS) U6.11(VSS) U6.21(EP) U7.1(GND) U7.5(PG) U7.9(EP) U$5.GND U$6.GND U$7.GND U$8.GND U$9.GND U$10.GND U$11.GND U$12.GND U$13.GND U$14.GND U$15.GND U$16.GND U$17.GND U$18.GND U$19.GND U$20.GND U$21.GND U$22.GND U$23.GND U$24.GND U$25.GND U$26.GND U$27.GND U$28.GND USB-C.A1(GND) USB-C.B1(GND) USB-C.SHIELD@1(SHIELD) USB-C.SHIELD@2(SHIELD) USB-C.SHIELD@3(SHIELD) USB-C.SHIELD@4(SHIELD) Y1.2(GND) Y1.4(GND)
IRQ: BLE.8(P0.25) U3.18((INT4/TOSC1)_PE4)
LED_OUT: 0.LED- 0.SMDLED-(LED-) 1.LED- 1.SMDLED-(LED-) 1U-BS.LED- 1U-BS.SMDLED-(LED-) 2.LED- 2.SMDLED-(LED-) 3.LED- 3.SMDLED-(LED-) 4.LED- 4.SMDLED-(LED-) 5.LED- 5.SMDLED-(LED-) 6.LED- 6.SMDLED-(LED-) 7.LED- 7.SMDLED-(LED-) 8.LED- 8.SMDLED-(LED-) 9.LED- 9.SMDLED-(LED-) '.LED- '.SMDLED-(LED-) ,-1.LED- ,.LED- -.LED- -.SMDLED-(LED-) .-1.LED- ..LED- /-1.LED- /.LED- =.LED- =.SMDLED-(LED-) [.LED- [.SMDLED-(LED-) ].LED- ].SMDLED-(LED-) A.LED- A.SMDLED-(LED-) ASHIFT.LED- ASHIFT.SMDLED-(LED-) B-1.LED- B.LED- BS-R.LED- BS-R.SMDLED-(LED-) BS.LED- BS.SMDLED-(LED-) C-1.LED- C.LED- CAPS-STEPPED.LED- CAPS-STEPPED.SMDLED-(LED-) CAPS-TRAD.LED- CAPS-TRAD.SMDLED-(LED-) D.LED- D.SMDLED-(LED-) DOWN.LED- DOWN.SMDLED-(LED-) E.LED- E.SMDLED-(LED-) ENTER-2U.LED- ENTER-2U.SMDLED-(LED-) ESC.LED- ESC.SMDLED-(LED-) F.LED- F.SMDLED-(LED-) G.LED- G.SMDLED-(LED-) H.LED- H.SMDLED-(LED-) I.LED- I.SMDLED-(LED-) J.LED- J.SMDLED-(LED-) K.LED- K.SMDLED-(LED-) L.LED- L.SMDLED-(LED-) LCMD.LED- LCMD.SMDLED-(LED-) LCTRL-LSMD1.MINUS1(MINUS) LCTRL-LSMD1.MINUS2(MINUS) LCTRL-LTHT1.1(MINUS) LED1.MINUS1(MINUS) LED1.MINUS2(MINUS) LED2.MINUS1(MINUS) LED2.MINUS2(MINUS) LED3.MINUS1(MINUS) LED3.MINUS2(MINUS) LED4.MINUS1(MINUS) LED4.MINUS2(MINUS) LED5.MINUS1(MINUS) LED5.MINUS2(MINUS) LED6.MINUS1(MINUS) LED6.MINUS2(MINUS) LED7.MINUS1(MINUS) LED7.MINUS2(MINUS) LED8.MINUS1(MINUS) LED8.MINUS2(MINUS) LED9.MINUS1(MINUS) LED9.MINUS2(MINUS) LED10.MINUS1(MINUS) LED10.MINUS2(MINUS) LEFT.LED- LEFT.SMDLED-(LED-) LOPT-LSMD1.MINUS1(MINUS) LOPT-LSMD1.MINUS2(MINUS) LOPT-LTHT1.1(MINUS) LSHIFT-LSMD.MINUS1(MINUS) LSHIFT-LSMD.MINUS2(MINUS) LSHIFT-LTHT.1(MINUS) M-1.LED- M.LED- N-1.LED- N.LED- O.LED- O.SMDLED-(LED-) P.LED- P.SMDLED-(LED-) Q1.3(D) Q.LED- Q.SMDLED-(LED-) R.LED- R.SMDLED-(LED-) RCMD-LSMD.MINUS1(MINUS) RCMD-LSMD.MINUS2(MINUS) RCMD-LTHT.1(MINUS) RIGHT-LSMD.MINUS1(MINUS) RIGHT-LSMD.MINUS2(MINUS) RIGHT-LTHT.1(MINUS) RMOD1-TRAD.LED- RMOD1-TRAD.SMDLED-(LED-) ROPT-1U.LED- ROPT-1U.SMDLED-(LED-) ROPT-TRAD.LED- ROPT-TRAD.SMDLED-(LED-) RSHIFT-1U.LED- RSHIFT-1U.SMDLED-(LED-) S.LED- S.SMDLED-(LED-) SEMICOL.LED- SEMICOL.SMDLED-(LED-) SPACE.LED- SPACE.SMDLED-(LED-) T.LED- T.SMDLED-(LED-) TAB.LED- TAB.SMDLED-(LED-) TS_SH.LED- TS_SH.SMDLED-(LED-) U.LED- U.SMDLED-(LED-) UP-LSMD.MINUS1(MINUS) UP-LSMD.MINUS2(MINUS) UP-LTHT.1(MINUS) V-1.LED- V.LED- W.LED- W.SMDLED-(LED-) X-1.LED- X.LED- Y.LED- Y.SMDLED-(LED-) Z-1.LED- Z.LED- |.LED- |.SMDLED-(LED-) ~.LED- ~.SMDLED-(LED-)
LSHIFT-LED-ITC1 [LED-ITC-Joins]: LSHIFT-LSMD.PLUS LSHIFT-LTHT.2(PLUS) LSHIFT-LTHT.3(PLUS) R70.1
MISO_3.3V: BLE.5(P0.22) U3.13((PDO/PCINT3/MISO)_PB3)
MOSI_3.3V: BLE.6(P0.23) U2.4(2Y)
MOSI_5V: U2.3(2A) U3.12((PDI/PCINT2/MOSI)_PB2)
N$1 [Matrix-Signals]: D15.A ~.MX1(P0)
N$2 [Matrix-Signals]: 1.MX1(P0) D16.A
N$3 [Matrix-Signals]: 3.MX1(P0) D18.A
N$4 [Matrix-Signals]: D30.A Q.MX1(P0)
N$5 [Matrix-Signals]: D29.A TAB.MX1(P0)
N$6 [Matrix-Signals]: 4.MX1(P0) D19.A
N$7 [Matrix-Signals]: D31.A W.MX1(P0)
N$8 [Matrix-Signals]: 2.MX1(P0) D17.A
N$9 [Matrix-Signals]: 5.MX1(P0) D20.A
N$10 [Matrix-Signals]: D32.A E.MX1(P0)
N$11 [Matrix-Signals]: 6.MX1(P0) D21.A
N$12 [Matrix-Signals]: D33.A R.MX1(P0)
N$13 [Matrix-Signals]: 7.MX1(P0) D22.A
N$14: R1.2 USB-C.A5(CC1)
N$15 [Matrix-Signals]: D34.A T.MX1(P0)
N$16 [Matrix-Signals]: 8.MX1(P0) D23.A
N$17 [Matrix-Signals]: D35.A Y.MX1(P0)
N$18 [Matrix-Signals]: 9.MX1(P0) D24.A
N$19 [Matrix-Signals]: D36.A U.MX1(P0)
N$20 [Matrix-Signals]: 0.MX1(P0) D25.A
N$21 [Matrix-Signals]: D37.A I.MX1(P0)
N$22 [Matrix-Signals]: -.MX1(P0) D26.A
N$23 [Matrix-Signals]: D38.A O.MX1(P0)
N$24 [Matrix-Signals]: =.MX1(P0) D27.A
N$25 [Matrix-Signals]: D39.A P.MX1(P0)
N$26 [Matrix-Signals]: 1U-BS.MX1(P0) BS.MX1(P0) D28.A
N$27: D3.A F1.2(OUT)
N$28 [Matrix-Signals]: [.MX1(P0) D40.A
N$29 [Matrix-Signals]: ].MX1(P0) D41.A
N$30 [Matrix-Signals]: D42.A |.MX1(P0)
N$31 [Power]: C1.2 D3.C L2.1
N$32 [Matrix-Signals]: A.MX1(P0) D58.A
N$33 [Matrix-Signals]: CAPS-STEPPED.MX1(P0) CAPS-TRAD.MX1(P0) D57.A
N$34 [Matrix-Signals]: D59.A S.MX1(P0)
N$35 [Matrix-Signals]: D60.A D.MX1(P0)
N$36 [Matrix-Signals]: D61.A F.MX1(P0)
N$37 [Matrix-Signals]: D62.A G.MX1(P0)
N$38 [Matrix-Signals]: D63.A H.MX1(P0)
N$39 [Matrix-Signals]: D64.A J.MX1(P0)
N$40 [Matrix-Signals]: D65.A K.MX1(P0)
N$41 [Matrix-Signals]: D66.A L.MX1(P0)
N$42 [Matrix-Signals]: D67.A SEMICOL.MX1(P0)
N$43 [Matrix-Signals]: '.MX1(P0) D68.A
N$44 [Matrix-Signals]: D69.A ENTER-2U.MX1(P0)
N$45 [Matrix-Signals]: D84.A Z-1.MX1(P0) Z.MX1(P0)
N$46: LED1.PLUS1(PLUS) LED1.PLUS2(PLUS) R12.1 Z-1.LED+ Z.LED+
N$47: R7.1 ~.LED+ ~.SMDLED+(LED+)
N$48 [Matrix-Signals]: D85.A X-1.MX1(P0) X.MX1(P0)
N$49 [Matrix-Signals]: C-1.MX1(P0) C.MX1(P0) D86.A
N$50 [Matrix-Signals]: D87.A V-1.MX1(P0) V.MX1(P0)
N$51 [Matrix-Signals]: B-1.MX1(P0) B.MX1(P0) D88.A
N$52 [Matrix-Signals]: D89.A N-1.MX1(P0) N.MX1(P0)
N$53 [Matrix-Signals]: D90.A M-1.MX1(P0) M.MX1(P0)
N$54 [Matrix-Signals]: ,-1.MX1(P0) ,.MX1(P0) D91.A
N$55 [Matrix-Signals]: D95.A RSHIFT-TRAD.MX1(P0) UP.MX1(P0)
N$56 [Matrix-Signals]: .-1.MX1(P0) ..MX1(P0) D92.A
N$57 [Matrix-Signals]: /-1.MX1(P0) /.MX1(P0) D93.A
N$58: BLE.24(P0.07) DFU.1
N$59 [Matrix-Signals]: ASHIFT.MX1(P0) D94.A RSHIFT-1U.MX1(P0) TS_SH.MX1(P0)
N$60: 2.LED+ 2.SMDLED+(LED+) R16.1
N$61 [Matrix-Signals]: D96.A ESC.MX1(P0)
N$62: R8.1 TAB.LED+ TAB.SMDLED+(LED+)
N$63 [Matrix-Signals]: D70.A LSHIFT-1U.MX1(P0) LSHIFT-TRAD.MX1(P0)
N$64: R2.1 USB-C.B5(CC2)
N$65: Q1.1(G) R71.2 R77.2
N$66: LED2.PLUS1(PLUS) LED2.PLUS2(PLUS) R19.1 X-1.LED+ X.LED+
N$67: C14.2 R73.1 R82.1 R83.1 U5.5(VCC)
N$68: LED4.PLUS1(PLUS) LED4.PLUS2(PLUS) R28.1 V-1.LED+ V.LED+
N$69: 8.LED+ 8.SMDLED+(LED+) R42.1
N$70: 5.LED+ 5.SMDLED+(LED+) R33.1
N$72: D111.A LCTRL1.MX1(P0) LCTRL.MX1(P0)
N$74: LOPT-LSMD1.PLUS LOPT-LTHT1.2(PLUS) LOPT-LTHT1.3(PLUS) R11.1
N$78: R74.2 U5.2(CS)
N$80: R78.1 R86.2 U7.3(FB)
N$82: LCTRL-LSMD1.PLUS LCTRL-LTHT1.2(PLUS) LCTRL-LTHT1.3(PLUS) R10.1
N$83: B-1.LED+ B.LED+ LED5.PLUS1(PLUS) LED5.PLUS2(PLUS) R30.1
N$84: LED6.PLUS1(PLUS) LED6.PLUS2(PLUS) N-1.LED+ N.LED+ R37.1
N$85: LED7.PLUS1(PLUS) LED7.PLUS2(PLUS) M-1.LED+ M.LED+ R38.1
N$86: ,-1.LED+ ,.LED+ LED8.PLUS1(PLUS) LED8.PLUS2(PLUS) R45.1
N$87: .-1.LED+ ..LED+ LED9.PLUS1(PLUS) LED9.PLUS2(PLUS) R47.1
N$88: /-1.LED+ /.LED+ LED10.PLUS1(PLUS) LED10.PLUS2(PLUS) R54.1
N$90: CAPS-STEPPED.LED+ CAPS-STEPPED.SMDLED+(LED+) CAPS-TRAD.LED+ CAPS-TRAD.SMDLED+(LED+) R9.1
N$91 [Matrix-Signals]: D113.A LOPT1.MX1(P0) LOPT.MX1(P0)
N$93 [Matrix-Signals]: D115.A LCMD.MX1(P0)
N$95: A.LED+ A.SMDLED+(LED+) R13.1
N$96: D117.A SPACE.MX1(P0)
N$97 [Matrix-Signals]: D119.A RCMD-1U.MX1(P0) RCMD-TRAD.MX1(P0)
N$98: Q.LED+ Q.SMDLED+(LED+) R14.1
N$99 [Matrix-Signals]: D121.A ROPT-1U.MX1(P0) ROPT-TRAD.MX1(P0)
N$100: R4.2 U3.43(PE2_(ALE/HWB))
N$101 [Matrix-Signals]: D123.A LEFT.MX1(P0) RMOD1-TRAD.MX1(P0)
N$102: 1.LED+ 1.SMDLED+(LED+) R15.1
N$103 [Matrix-Signals]: D125.A DOWN.MX1(P0)
N$105 [Matrix-Signals]: D127.A RIGHT.MX1(P0) RMOD2-TRAD.MX1(P0)
N$106: LCMD.LED+ LCMD.SMDLED+(LED+) R20.1
N$107: R18.1 S.LED+ S.SMDLED+(LED+)
N$108: R17.1 W.LED+ W.SMDLED+(LED+)
N$110: 3.LED+ 3.SMDLED+(LED+) R24.1
N$111: E.LED+ E.SMDLED+(LED+) R23.1
N$112: D.LED+ D.SMDLED+(LED+) R22.1
N$113: C-1.LED+ C.LED+ LED3.PLUS1(PLUS) LED3.PLUS2(PLUS) R21.1
N$114: F.LED+ F.SMDLED+(LED+) R27.1
N$115: R26.1 R.LED+ R.SMDLED+(LED+)
N$116: 4.LED+ 4.SMDLED+(LED+) R25.1
N$117: R32.1 T.LED+ T.SMDLED+(LED+)
N$118: G.LED+ G.SMDLED+(LED+) R31.1
N$119: R29.1 SPACE.LED+ SPACE.SMDLED+(LED+)
N$120: H.LED+ H.SMDLED+(LED+) R36.1
N$121: R35.1 Y.LED+ Y.SMDLED+(LED+)
N$122: 6.LED+ 6.SMDLED+(LED+) R34.1
N$123: 7.LED+ 7.SMDLED+(LED+) R41.1
N$124: R40.1 U.LED+ U.SMDLED+(LED+)
N$125: J.LED+ J.SMDLED+(LED+) R39.1
N$126: K.LED+ K.SMDLED+(LED+) R44.1
N$127: I.LED+ I.SMDLED+(LED+) R43.1
N$129: 9.LED+ 9.SMDLED+(LED+) R50.1
N$130: O.LED+ O.SMDLED+(LED+) R49.1
N$131: L.LED+ L.SMDLED+(LED+) R48.1
N$132: R55.1 ROPT-1U.LED+ ROPT-1U.SMDLED+(LED+) ROPT-TRAD.LED+ ROPT-TRAD.SMDLED+(LED+)
N$133: R53.1 SEMICOL.LED+ SEMICOL.SMDLED+(LED+)
N$134: P.LED+ P.SMDLED+(LED+) R52.1
N$135: 0.LED+ 0.SMDLED+(LED+) R51.1
N$136: -.LED+ -.SMDLED+(LED+) R60.1
N$137: [.LED+ [.SMDLED+(LED+) R59.1
N$138: '.LED+ '.SMDLED+(LED+) R58.1
N$139: ASHIFT.LED+ ASHIFT.SMDLED+(LED+) R57.1 RSHIFT-1U.LED+ RSHIFT-1U.SMDLED+(LED+)
N$140: LEFT.LED+ LEFT.SMDLED+(LED+) R56.1 RMOD1-TRAD.LED+ RMOD1-TRAD.SMDLED+(LED+)
N$141: DOWN.LED+ DOWN.SMDLED+(LED+) R65.1
N$142: ENTER-2U.LED+ ENTER-2U.SMDLED+(LED+) R63.1
N$143: ].LED+ ].SMDLED+(LED+) R62.1
N$144: =.LED+ =.SMDLED+(LED+) R61.1
N$145: 1U-BS.LED+ 1U-BS.SMDLED+(LED+) BS.LED+ BS.SMDLED+(LED+) R69.1
N$146: R68.1 |.LED+ |.SMDLED+(LED+)
N$147: ESC.LED+ ESC.SMDLED+(LED+) R67.1
N$148: L3.2 U7.7(SW)
N$149: BS-R.MX1(P0) D1.A
N$150: R88.2 R89.1
N$151: R87.2 U6.5(THERM)
N$152: R89.2 U6.13(PROG1)
N$153: R90.2 U6.12(PROG3)
N$156: BLE.34(P0.16) F.RST.1
N$158: C10.2 D143.3(K1K2) U1.1(IN) U1.3(EN)
N$159: BS-R.LED+ BS-R.SMDLED+(LED+) R81.1
N$160: U$5.DOUT U$6.DIN
N$161: U$6.DOUT U$7.DIN
N$162: U$7.DOUT U$8.DIN
N$163: U$8.DOUT U$9.DIN
N$164: U$9.DOUT U$10.DIN
N$165: U$10.DOUT U$11.DIN
N$166: U$11.DOUT U$12.DIN
N$167: U$13.DOUT U$14.DIN
N$168: U$21.DOUT U$22.DIN
N$169: U$22.DOUT U$23.DIN
N$170: U$14.DOUT U$15.DIN
N$171: U$15.DOUT U$16.DIN
N$172: U$23.DOUT U$24.DIN
N$173: U$24.DOUT U$25.DIN
N$174: U$16.DOUT U$17.DIN
N$175: U$17.DOUT U$18.DIN
N$176: U$18.DOUT U$19.DIN
N$177: U$25.DOUT U$26.DIN
N$178: U$26.DOUT U$27.DIN
N$179: U$19.DOUT U$20.DIN
N$180: U$27.DOUT U$28.DIN
N$181: R85.2 U$5.DIN
N$184: U$12.DOUT U$13.DIN
N$185: U$20.DOUT U$21.DIN
OC: Q2.4(G1) U5.3(OC)
OD: Q2.5(G2) U5.1(OD)
RCMD-LED-ITC1 [LED-ITC-Joins]: R46.1 RCMD-LSMD.PLUS RCMD-LTHT.2(PLUS) RCMD-LTHT.3(PLUS)
RIGHT-LED-ITC1 [LED-ITC-Joins]: R66.1 RIGHT-LSMD.PLUS RIGHT-LTHT.2(PLUS) RIGHT-LTHT.3(PLUS)
ROW1 [Matrix-Signals]: D15.C D16.C D17.C D18.C D19.C D20.C D21.C D22.C D23.C D24.C D25.C D26.C D27.C D28.C U3.61(PF0_(ADC0))
ROW2 [Matrix-Signals]: D29.C D30.C D31.C D32.C D33.C D34.C D35.C D36.C D37.C D38.C D39.C D40.C D41.C D42.C U3.60(PF1_(ADC1))
ROW3 [Matrix-Signals]: D1.C D57.C D58.C D59.C D60.C D61.C D62.C D63.C D64.C D65.C D66.C D67.C D68.C D69.C U3.59(PF2_(ADC2))
ROW4 [Matrix-Signals]: D70.C D84.C D85.C D86.C D87.C D88.C D89.C D90.C D91.C D92.C D93.C D94.C D95.C D96.C U3.58(PF3_(ADC3))
ROW5 [Matrix-Signals]: D111.C D113.C D115.C D117.C D119.C D121.C D123.C D125.C D127.C U3.57(PF4_(ADC4/TCK))
RST_SW: C1_RST.2 D4.A R1_RST.1 RST.2 U3.20(!RESET)
SCK_3.3V: BLE.4(P0.21) U2.6(1Y)
SCK_5V: U2.1(1A) U3.11((PCINT1/SCLK)_PB1)
SWCLK: BLE.36(SWCLK) J2.P$2(SWCLK)
SWRST_3.3V: BLE.35(NRESET/SWDIO) J2.P$1(SWDIO) R80.2 U$1.S
SWRST_5V: R79.2 U3.29((ICP1)_PD4) U$1.D
UCAP: C7.2 U3.7(UCAP)
UG: R85.1 U3.15((PCINT5/OC.1A)_PB5)
UP-LED-ITC1 [LED-ITC-Joins]: R64.1 TS_SH.LED+ TS_SH.SMDLED+(LED+) UP-LSMD.PLUS UP-LTHT.2(PLUS) UP-LTHT.3(PLUS)
USB_1_N [USB-Data]: R6.2 U3.4(D-)
USB_1_P [USB-Data]: R5.2 U3.5(D+)
USB_C_N: U4.4(I/O2_2) USB-C.A7(DN1) USB-C.B7(DN2)
USB_C_P: U4.6(I/O1_2) USB-C.A6(DP1) USB-C.B6(DP2)
USB_N [USB-Data]: R6.1 U4.3(I/O2_1)
USB_P [USB-Data]: R5.1 U4.1(I/O1_1)
VBUS: C6.2 F1.1(IN) U3.8(VBUS) U4.5(VBUS) USB-C.A4(VBUS) USB-C.B4(VBUS)
VCC [Power]: C13.2 C15.2 C16.2 C19.2 C20.2 C21.2 C22.2 C23.2 C24.2 C25.2 C26.2 C27.2 C28.2 C29.2 C30.2 C31.2 C32.2 C33.2 C34.2 C35.2 C36.2 C37.2 C38.2 C39.2 C40.2 C41.2 C42.2 C44.2 C45.2 D4.C D143.2(A2) R1_RST.2 R7.2 R8.2 R9.2 R10.2 R11.2 R12.2 R13.2 R14.2 R15.2 R16.2 R17.2 R18.2 R19.2 R20.2 R21.2 R22.2 R23.2 R24.2 R25.2 R26.2 R27.2 R28.2 R29.2 R30.2 R31.2 R32.2 R33.2 R34.2 R35.2 R36.2 R37.2 R38.2 R39.2 R40.2 R41.2 R42.2 R43.2 R44.2 R45.2 R46.2 R47.2 R48.2 R49.2 R50.2 R51.2 R52.2 R53.2 R54.2 R55.2 R56.2 R57.2 R58.2 R59.2 R60.2 R61.2 R62.2 R63.2 R64.2 R65.2 R66.2 R67.2 R68.2 R69.2 R70.2 R78.2 R79.1 R81.2 U3.3(UVCC) U3.21(VCC) U3.52(VCC) U3.64(AVCC) U7.2(VOUT) U$5.VCC(VDD) U$6.VCC(VDD) U$7.VCC(VDD) U$8.VCC(VDD) U$9.VCC(VDD) U$10.VCC(VDD) U$11.VCC(VDD) U$12.VCC(VDD) U$13.VCC(VDD) U$14.VCC(VDD) U$15.VCC(VDD) U$16.VCC(VDD) U$17.VCC(VDD) U$18.VCC(VDD) U$19.VCC(VDD) U$20.VCC(VDD) U$21.VCC(VDD) U$22.VCC(VDD) U$23.VCC(VDD) U$24.VCC(VDD) U$25.VCC(VDD) U$26.VCC(VDD) U$27.VCC(VDD) U$28.VCC(VDD)
VCC3.3 [Power]: BLE.3(AVDD) BLE.14(VDD) C11.2 C12.2 D143.1(A1) R3.2 R80.1 U1.5(OUT) U2.5(VCC) U$1.G
VFILTER: C2.2 C3.2 C4.2 L2.2 U6.2(VPCC) U6.4(PROG2) U6.9(!TE) U6.17(CE) U6.18(IN) U6.19(IN)
VMCP: C43.2 L3.1 U6.1(OUT) U6.20(OUT) U7.4(ILIM) U7.6(EN) U7.8(VIN)
XTAL1: C8.1 U3.24(XTAL1) Y1.1
XTAL2: C9.1 U3.23(XTAL2) Y1.3
Unconnected: Q2.1(D12) Q2.8(D12) S2.P1 U1.4(BYP) U3.1((INT.6/AIN.0)_PE6) U3.2((INT.7/AIN.1/UVCON)_PE7) U3.9((IUID)_PE3) U3.10((SS/PCINT0)_PB0) U3.17((PCINT7/OC.0A/OC.1C)_PB7) U3.19((INT.5/TOSC2)_PE5) U3.25((OC0B/SCL/INT0)_PD0) U3.26((OC2B/SDA/INT1)_PD1) U3.27((RXD1/INT2)_PD2) U3.28((TXD1/INT3)_PD3) U3.30((XCK1)_PD5) U3.31((T1)_PD6) U3.32((T0)_PD7) U3.39(PC4_(A12/OC.3C)) U3.40(PC5_(A13/OC.3B)) U3.41(PC6_(A14/OC.3A)) U3.42(PC7_(A15/IC.3/CLKO)) U3.54(PF7_(ADC7/TDI)) U3.56(PF5_(ADC5/TMS)) U5.4(TD) U6.6(!PG) U6.7(STAT2) U6.8(STAT1/*LBO) U$28.DOUT U$29.+ U$29.- U$30.+ U$30.- U$31.+ U$31.- U$32.+ U$32.- U$33.+ U$33.- U$34.+ U$34.- U$35.+ U$35.- U$36.+ U$36.- U$37.+ U$37.- U$38.+ U$38.- U$39.+ U$39.- U$40.+ U$40.- U$41.+ U$41.- U$42.+ U$42.- U$43.+ U$43.- U$44.+ U$44.- U$45.+ U$45.- U$46.+ U$46.- U$47.+ U$47.- U$48.+ U$48.- U$49.+ U$49.- U$50.+ U$50.- U$51.+ U$51.- U$52.+ U$52.- U$53.+ U$53.- U$54.+ U$54.- U$55.+ U$55.- U$56.+ U$56.- U$57.+ U$57.- U$58.+ U$58.- U$59.+ U$59.- U$60.+ U$60.- U$61.+ U$61.- U$62.+ U$62.- U$63.+ U$63.- U$64.+ U$64.- U$65.+ U$65.- U$66.+ U$66.- U$67.+ U$67.- U$68.+ U$68.- U$69.+ U$69.- U$70.+ U$70.- U$71.+ U$71.- U$72.+ U$72.- U$73.+ U$73.- U$74.+ U$74.- U$75.+ U$75.- U$76.+ U$76.- U$77.+ U$77.- U$78.+ U$78.- U$79.+ U$79.- U$80.+ U$80.- U$81.+ U$81.- U$82.+ U$82.- U$83.+ U$83.- U$84.+ U$84.- U$85.+ U$85.- U$86.+ U$86.- U$87.+ U$87.- U$88.+ U$88.- U$89.+ U$89.- U$90.+ U$90.- U$91.+ U$91.- U$92.+ U$92.- USB-C.A8(SBU1) USB-C.B8(SBU2)

## Notes on the sheet
- 1 | 2 | 3 | 4 | 5 | 6 | 7 | 8 | 9 | 10 | 11 | 12 | 13 | 14
- 1
- 2
- 3
- 4
- 4.5
- 5
- 5.5
- MDBT40-256v3 BLE Subsystem
- RGB Underglow Subsystem
- Main MDBT40 Chip | Voltage Regulation
- USB Connector | MDBT40 Bluetooth Module | 5V -> 3.3V Step Down | Underglow RGB LED's
- USB Connector
- Level-Shift for BLE | Level Shifters
- Decoupling Capacitors
- MCU Support | Reset Switch
- Support Caps | Reset
- Clock Signal | Programming Pads
- Crystal
- Battery Connector | Battery Level
- Note that 12pF is for a crystal w/
  Load Capacitance of 10pF. Part 
  chosen for crystal is 10pF. Adjust
  if necessary. Cap = 2*CL - 2*C_[stray]
  where C_[stray] is assumed to be 2pF. 
  Closest common value chosen
- Power Management Subsystem
- Decoupling Caps
- SMD LED Pick and Place Positions\
- USB Filtering and Protection | Battery Charging | DC-DC Boost Converter | Li-Ion Battery Protection
- Datasheet for FS312F-G
  gives 100Ω for VCC Resist.
  Equiv. = 3x 300Ω in Parr.
- These LED's are not electrically connected and are only used to add positions
  for the Pick-and-Place Centroid file needed for assembly.
- Per-Key LED Subsystem
- VBUS is passed through a 500mA fuse followed by a Schottky Diode
  This creates overcurrent and backflow protection
  High Frequency EMC is filtered by a ferrite bead
  and output is smoothed by decoupling capacitors

## Library data of the parts
0 1 1U-BS 2-9 ' - = [ ] A ASHIFT BS BS-R CAPS-STEPPED CAPS-TRAD D DOWN E ENTER-2U ESC F G H I J K L LCMD LEFT O P Q R RMOD1-TRAD ROPT-1U ROPT-TRAD RSHIFT-1U S SEMICOL SPACE T TAB TS_SH U W Y | ~ = Keyboard:KEYSWITCH-THTSMDLED
, ,-1 . .-1 / /-1 B B-1 C C-1 M M-1 N N-1 V V-1 X X-1 Z Z-1 = Keyboard:KEYSWITCH-LED
BLE = BLE Chip:MDBT40-NO-EXTRA: Raytac Corporation MDBT40-256V3(16Kb), MDBT40-P256V3(16Kb), MDBT40-256RV3(32Kb), MDBT40-P256RV3(32Kb), Bluetooth Low Energy Module based on Noridc nRF51822 Source: Raytac datasheet
C1 C1_RST C2-C16 C19-C45 = Components:CAPACITOR
D1 D15-D42 D57-D70 D84-D96 D111 D113 D115 D117 D119 D121 D123 D125 D127 D130 = diode:DIODE-: DIODE
D3 D4 = Diodes:CESD5V0D1: SOD-123 Plastic-Encapsulate Diodes Uni-direction ESD Protection Diode Manufacturer's datasheet <https://seeeddoc.github.io/Open_parts_library/res/304060001.pdf>; CREATED_BY: PCBLayout.com; MANUFACTURER: JCET; MPN: CESD5V0D1; PACKAGE: SOD-123
D143 = PMEG2005CT:PMEG2005CT: 500 mA low VF dual MEGA Schottky barrier rectifier Planar Maximum Efficiency General Application (MEGA) Schottky barrier rectifier in common cathode configuration with an integrated guard ring for stress protection, encapsulated in a SOT23 (TO-236AB) small Surface-Mounted Device (SMD) plastic package. AAL Eindhoven MK; AVAILABILITY: Unavailable; DESCRIPTION: Diode Array 1 Pair Common Cathode Schottky 20V 500mA Surface Mount TO-236-3, SC-59, SOT-23-3; MF: NXP Semiconductors; MP: PMEG2005CT; PACKAGE: TO-236 NXP Semiconductors; PRICE: None
DFU F.RST RST = jumper:SJ: SMD solder JUMPER
F1 = MF-USMF075-2:CAPC1210X112N; A_MAX: 1.12; A_MIN: 1.12; A_NOM: 1.12; D_MAX: 1.422; D_MIN: 1.118; D_NOM: 1.27; E_MAX: 1.172; E_MIN: 0.868; E_NOM: 1.02; L1_MAX: 0.508; L1_MIN: 0.204; L1_NOM: 0.356; L_MAX: 0.508; L_MIN: 0.204; L_NOM: 0.356; MANUFACTURER: Knowles Novacap; STANDARD: IPC 7351B
J1 = S2B-PH-K-S_LF__SN_:S2B-PH-K-S(LF)(SN): PH Series 2 Position 2.0 mm Through Hole Side Entry Shrouded Header; DESCRIPTION: Connector Header Through Hole, Right Angle 2 position; DIGI-KEY_PART_NUMBER: 455-1719-ND; MF: JST Sales America Inc.; MP: S2B-PH-K-S(LF)(SN); PACKAGE: Custom Package JST Sales America Inc.
J2 = Headers:SWD-2-WIRE
L2 = inductors:BLM15H: EMIFIL (R) Chip Ferrite Bead for GHz Noise Source: http://www.murata.com/ Ferrite Bead BLM15H.pdf
L3 = Inductor:L: Inductor Fixed - Generic; CATEGORY: Inductor; SUB-CATEGORY: Fixed
LCTRL LCTRL1 LOPT LOPT1 LSHIFT-1U LSHIFT-TRAD RCMD-1U RCMD-TRAD RIGHT RMOD2-TRAD RSHIFT-TRAD UP = Keyboard:KEYSWITCH-PLAIN
LCTRL-LSMD1 LCTRL-LTHT1 LED1-LED10 LOPT-LSMD1 LOPT-LTHT1 LSHIFT-LSMD LSHIFT-LTHT RCMD-LSMD RCMD-LTHT RIGHT-LSMD RIGHT-LTHT UP-LSMD UP-LTHT = LED:LED: Single color LED
Q1 = FDN337N:FDN337N: N-Channel MOSFET Logic Level Enhancement Mode Field Effect Transistor; ARROW_ELECTRONICS-PURCHASE-URL: https://snapeda.com/shop?store=Arrow+Electronics&id=4816767; AVAILABILITY: Unavailable; DESCRIPTION: MOSFET SSOT-3 N-CH 30V; DIGIKEY-PURCHASE-URL: https://snapeda.com/shop?store=DigiKey&id=4816767; MF: ON Semiconductor / Fairchild; MOUSER-PURCHASE-URL: https://snapeda.com/shop?store=Mouser&id=4816767; MP: FDN337N; PACKAGE: None; PRICE: None
Q2 = FS8205A:FS8205A: N/A; MF: Fortune Semiconductor; MP: FS8205A; PACKAGE: Package
R1 R1_RST R2-R75 R77-R83 R85-R90 = Components:RESISTOR
S2 = SSSS213000:SSSS213000: Switch Slide Spdt 300ma 6v
U1 = MIC5205-3.3YM5TR:MIC5205-3.3YM5TR: 150mA Low-Noise LDO Regulator; DESCRIPTION: Linear Voltage Regulator IC 1 Output 150mA SOT-23-5; DIGI-KEY_PART_NUMBER: 576-1259-1-ND; MF: Microchip; MP: MIC5205-3.3YM5-TR; PACKAGE: SOT-23-5 Microchip
U2 = SN74LVC2G34DBVR:SN74LVC2G34DBVR; DESCRIPTION: Buffer, Non-Inverting 2 Element 1 Bit per Element Push-Pull Output SOT-23-6; DIGI-KEY_PART_NUMBER: 296-13496-1-ND; MF: Texas Instruments; MP: SN74LVC2G34DBVR; PACKAGE: SOT-23-6 Texas Instruments; TEXAS_INSTRUMENTS-PURCHASE-URL: https://snapeda.com/shop?store=Texas+Instruments&id=296803
U3 = AT90USB1286-MU:AT90USB1286-MU; AVAILABILITY: Unavailable; DESCRIPTION: IC MCU 8BIT 128KB FLASH 64QFN; DIGIKEY-PURCHASE-URL: https://snapeda.com/shop?store=DigiKey&id=4833096; MF: Microchip Technology; MOUSER-PURCHASE-URL: https://snapeda.com/shop?store=Mouser&id=4833096; MP: AT90USB1286-MU; PACKAGE: None; PRICE: None
U4 = USBLC6-2P6:USBLC6-2P6: The USBLC6-2SC6 and USBLC6-2P6 are monolithic application specific devices dedicated to ESD protection of high speed interfaces, such as USB 2.0, Ethernet links and video lines. The very low line capacitance secures a high level of signal integrity without compromising in protecting sensitive chips against the most stringently characterized ESD strikes Buy Part <https://snapeda.com/parts/USBLC6-2P6/STMicroelectronics/view-part/?ref=eda>; AVAILABILITY: Warning; DESCRIPTION: 17V Clamp 5A (8/20µs) Ipp Tvs Diode Surface Mount SOT-666; MF: STMicroelectronics; MOUSER-PURCHASE-URL: https://snapeda.com/shop?store=Mouser&id=106846; MP: USBLC6-2P6; PACKAGE: SOT-666 STMicroelectronics; PRICE: None
U5 = FS312F-G:FS312F-G; COPYRIGHT: Copyright (C) 2016 Accelerated Designs. All rights reserved; MANUFACTURER_PART_NUMBER: NCP802SN1T1; SOURCELIBRARY: ONSemi_2017-12-12_4; VENDOR: ON Semiconductor
U6 = MCP73871-2AAI_ML:MCP73871-2AAI/ML: Buy Part <https://snapeda.com/parts/MCP73871-2AAI/ML/Microchip/view-part/?ref=eda>; AVAILABILITY: Good; DESCRIPTION: Charger IC Lithium Ion/Polymer 20-QFN (4x4); DIGIKEY-PURCHASE-URL: https://snapeda.com/shop?store=DigiKey&id=281642; MF: Microchip; MOUSER-PURCHASE-URL: https://snapeda.com/shop?store=Mouser&id=281642; MP: MCP73871-2AAI/ML; PACKAGE: QFN-20 Microchip; PRICE: None
U7 = TPS61252DSGT:TPS61252DSGT; DESCRIPTION: 3.5MHz, 1.5A, 92% Efficient Boost Converter with Adjustable Input Current Limit 8-WSON; DIGI-KEY_PART_NUMBER: 296-27867-1-ND; MF: Texas Instruments; MP: TPS61252DSGT; PACKAGE: WSON-8 Texas Instruments; TEXAS_INSTRUMENTS-PURCHASE-URL: https://snapeda.com/shop?store=Texas+Instruments&id=214822
U$1 = BSS138:BSS138: BSS138 N-Channel Logic Level Enhancement Mode Field Effect Transistor; ARROW_ELECTRONICS-PURCHASE-URL: https://snapeda.com/shop?store=Arrow+Electronics&id=2773844; AVAILABILITY: Unavailable; DESCRIPTION: N-Channel 50V 220mA (Ta) 360mW (Ta) Surface Mount SOT-23-3; DIGIKEY-PURCHASE-URL: https://snapeda.com/shop?store=DigiKey&id=2773844; MF: MICROSS/On Semiconductor; MOUSER-PURCHASE-URL: https://snapeda.com/shop?store=Mouser&id=2773844; MP: BSS138; PACKAGE: TO-236-3 Micross; PRICE: None
U$5-U$28 = LED:SK6805
U$29-U$92 = Components:LED
USB-C = TYPE-C-31-M-12:USB-C: Korean Hroparts Elec TYPE-C-31-M-12 USB - Type C Female 16 8.94*7.3mm USB Connectors RoHS Mfr.Part # : TYPE-C-31-M-12 Package : 8.94*7.3mm Number of Contacts : 16 Number of Ports : 1 Mounting Angle : Horizontal Current Rating : 0.25A Datasheet: https://datasheet.lcsc.com/szlcsc/1811131825_Korean-Hroparts-Elec-TYPE-C-31-M-12_C165948.pdf
Y1 = Components:CRYSTAL-4PIN

## Net classes
1 Matrix-Signals: width 0.152 mm, drill 0.152 mm, clearance 0.152 mm
4 USB-Data: width 0.203 mm